# Altium project PCB_Project1.PrjPCB
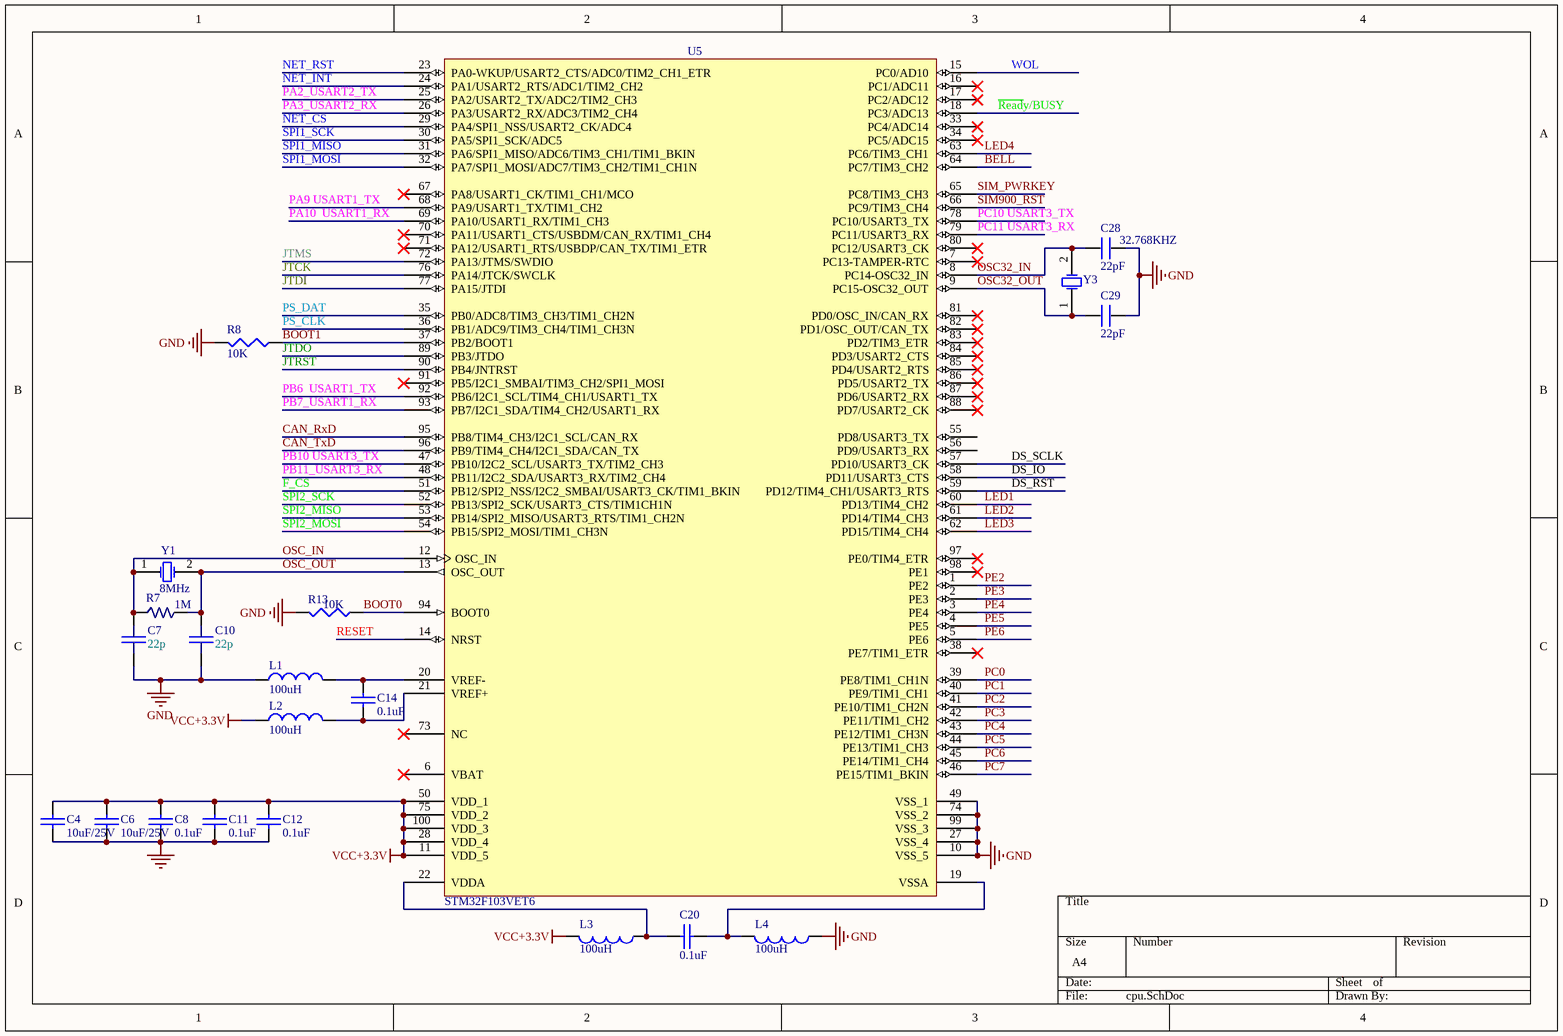
[diagram p0: cpu.SchDoc]
6 sheets, 379 parts. Net scope: global (net labels, ports and power ports of the same name join across sheets).
Board file: 存储物柜V1.1.PcbDoc
Sheets:
  cpu.SchDoc
  other.SchDoc
  power&down.SchDoc
  net_w5500.SchDoc
  gsm_sim900.SchDoc
  存储物柜V1.1.SchDoc

## Sheet cpu.SchDoc
size A4

### Parts
(Parts that share a designator on the sheet are numbered #1, #2 ... from top to bottom, then left to right.)
C4#1  10uF/25V  [0805]
C6#1  10uF/25V  [0805]
C7#1  22p  [0603]
C8#1  0.1uF  [0603]
C10#1  22p  [0603]
C11#1  0.1uF  [0603]
C12#1  0.1uF  [0603]
C14#1  0.1uF  [0603]
C20#1  0.1uF  [0603]
C28  22pF  [0603]
C29  22pF  [0603]
L1#1  100uH  [0805]
L2#1  100uH  [0805]
L3#1  100uH  [0805]
L4#1  100uH  [0805]
R7#1  1M  [0805]
R8#1  10K  [0805]
R13#1  10K  [0603]
U5#1  STM32F103VET6  [LQFP100_N]
Y1#1  8MHz  [XTAL_US]
Y3  32.768KHZ  [CS-308]

### Nets
GND: C4#1.1 C6#1.1 C7#1.2 C8#1.1 C10#1.2 C11#1.1 C12#1.1 C28.1 C29.1 L1#1.1 L4#1.1 R8#1.2 R13#1.2 U5#1.10(VSS_5) U5#1.27(VSS_4) U5#1.49(VSS_1) U5#1.74(VSS_2) U5#1.99(VSS_3)
VCC+3.3V: C4#1.2 C6#1.2 C8#1.2 C11#1.2 C12#1.2 L2#1.1 L3#1.2 U5#1.11(VDD_5) U5#1.28(VDD_4) U5#1.50(VDD_1) U5#1.75(VDD_2) U5#1.100(VDD_3)
BELL: U5#1.64(PC7/TIM3_CH2)
BOOT0: R13#1.1 U5#1.94(BOOT0)
BOOT1: R8#1.1 U5#1.37(PB2/BOOT1)
CAN_RxD: U5#1.95(PB8/TIM4_CH3/I2C1_SCL/CAN_RX)
CAN_TxD: U5#1.96(PB9/TIM4_CH4/I2C1_SDA/CAN_TX)
DS_IO: U5#1.58(PD11/USART3_CTS)
DS_RST: U5#1.59(PD12/TIM4_CH1/USART3_RTS)
DS_SCLK: U5#1.57(PD10/USART3_CK)
F_CS: U5#1.51(PB12/SPI2_NSS/I2C2_SMBAI/USART3_CK/TIM1_BKIN)
JTCK: U5#1.76(PA14/JTCK/SWCLK)
JTDI: U5#1.77(PA15/JTDI)
JTDO: U5#1.89(PB3/JTDO)
JTMS: U5#1.72(PA13/JTMS/SWDIO)
JTRST: U5#1.90(PB4/JNTRST)
LED1: U5#1.60(PD13/TIM4_CH2)
LED2: U5#1.61(PD14/TIM4_CH3)
LED3: U5#1.62(PD15/TIM4_CH4)
LED4: U5#1.63(PC6/TIM3_CH1)
NET_CS: U5#1.29(PA4/SPI1_NSS/USART2_CK/ADC4)
NET_INT: U5#1.24(PA1/USART2_RTS/ADC1/TIM2_CH2)
NET_RST: U5#1.23(PA0-WKUP/USART2_CTS/ADC0/TIM2_CH1_ETR)
OSC32_IN: C28.2 U5#1.8(PC14-OSC32_IN) Y3.2(OSC2)
OSC32_OUT: C29.2 U5#1.9(PC15-OSC32_OUT) Y3.1(OSC1)
OSC_IN: C7#1.1 R7#1.1 U5#1.12(OSC_IN) Y1#1.1(OSC1)
OSC_OUT: C10#1.1 R7#1.2 U5#1.13(OSC_OUT) Y1#1.2(OSC2)
PA2_USART2_TX: U5#1.25(PA2/USART2_TX/ADC2/TIM2_CH3)
PA3_USART2_RX: U5#1.26(PA3/USART2_RX/ADC3/TIM2_CH4)
PA9 USART1_TX: U5#1.68(PA9/USART1_TX/TIM1_CH2)
PA10  USART1_RX: U5#1.69(PA10/USART1_RX/TIM1_CH3)
PB6  USART1_TX: U5#1.92(PB6/I2C1_SCL/TIM4_CH1/USART1_TX)
PB7_USART1_RX: U5#1.93(PB7/I2C1_SDA/TIM4_CH2/USART1_RX)
PB10 USART3_TX: U5#1.47(PB10/I2C2_SCL/USART3_TX/TIM2_CH3)
PB11_USART3_RX: U5#1.48(PB11/I2C2_SDA/USART3_RX/TIM2_CH4)
PC0: U5#1.39(PE8/TIM1_CH1N)
PC1: U5#1.40(PE9/TIM1_CH1)
PC2: U5#1.41(PE10/TIM1_CH2N)
PC3: U5#1.42(PE11/TIM1_CH2)
PC4: U5#1.43(PE12/TIM1_CH3N)
PC5: U5#1.44(PE13/TIM1_CH3)
PC6: U5#1.45(PE14/TIM1_CH4)
PC7: U5#1.46(PE15/TIM1_BKIN)
PC10 USART3_TX: U5#1.78(PC10/USART3_TX)
PC11 USART3_RX: U5#1.79(PC11/USART3_RX)
PE2: U5#1.1(PE2)
PE3: U5#1.2(PE3)
PE4: U5#1.3(PE4)
PE5: U5#1.4(PE5)
PE6: U5#1.5(PE6)
PS_CLK: U5#1.36(PB1/ADC9/TIM3_CH4/TIM1_CH3N)
PS_DAT: U5#1.35(PB0/ADC8/TIM3_CH3/TIM1_CH2N)
~{Read}y/BUSY: U5#1.18(PC3/ADC13)
RESET: U5#1.14(NRST)
SIM900_RST: U5#1.66(PC9/TIM3_CH4)
SIM_PWRKEY: U5#1.65(PC8/TIM3_CH3)
SPI1_MISO: U5#1.31(PA6/SPI1_MISO/ADC6/TIM3_CH1/TIM1_BKIN)
SPI1_MOSI: U5#1.32(PA7/SPI1_MOSI/ADC7/TIM3_CH2/TIM1_CH1N)
SPI1_SCK: U5#1.30(PA5/SPI1_SCK/ADC5)
SPI2_MISO: U5#1.53(PB14/SPI2_MISO/USART3_RTS/TIM1_CH2N)
SPI2_MOSI: U5#1.54(PB15/SPI2_MOSI/TIM1_CH3N)
SPI2_SCK: U5#1.52(PB13/SPI2_SCK/USART3_CTS/TIM1CH1N)
WOL: U5#1.15(PC0/AD10)
NetC14#1_1: C14#1.1 L1#1.2 U5#1.20(VREF-)
NetC14#1_2: C14#1.2 L2#1.2 U5#1.21(VREF+)
NetC20#1_1: C20#1.1 L3#1.1 U5#1.22(VDDA)
NetC20#1_2: C20#1.2 L4#1.2 U5#1.19(VSSA)

Not connected (* = marked no-connect by the designer): U5#1 6(VBAT)* 7(PC13-TAMPER-RTC)* 16(PC1/ADC11)* 17(PC2/ADC12)* 33(PC4/ADC14)* 34(PC5/ADC15)* 38(PE7/TIM1_ETR)* 55(PD8/USART3_TX) 56(PD9/USART3_RX) 67(PA8/USART1_CK/TIM1_CH1/MCO)* 70(PA11/USART1_CTS/USBDM/CAN_RX/TIM1_CH4)* 71(PA12/USART1_RTS/USBDP/CAN_TX/TIM1_ETR)* 73(NC)* 80(PC12/USART3_CK)* 81(PD0/OSC_IN/CAN_RX)* 82(PD1/OSC_OUT/CAN_TX)* 83(PD2/TIM3_ETR)* 84(PD3/USART2_CTS)* 85(PD4/USART2_RTS)* 86(PD5/USART2_TX)* 87(PD6/USART2_RX)* 88(PD7/USART2_CK)* 91(PB5/I2C1_SMBAI/TIM3_CH2/SPI1_MOSI)* 97(PE0/TIM4_ETR)* 98(PE1)*

### Library data of the parts
C4#1 C6#1 C8#1 C11#1 C12#1 C14#1 C20#1 = CAP
C7#1 C10#1 = CAP: 陶瓷电容
C28 C29 = C
L1#1 L2#1 L3#1 L4#1 = INDUCTOR
R7#1 = RES-1%: 高精度电阻
R8#1 R13#1 = RES1
U5#1 = STM32F103VET6: STM32 ARM-based 32-bit MCU with 64 Kbytes Flash, 100-pin LQFP, Industrial Temperature; Published: 30-May-2008; DatasheetVersion: rev6, Mar-2008; PackageVersion: Mar-2008; PackageReference: LQFP100; Publisher: Altium Limited; PackageDescription: 100-Pin Low-Profile Quad Flat Pack, 14 x 14 mm Body, 0.5 mm Pitch (LQFP100); ComponentLink1Description: Manufacturer Link; ComponentLink1URL: www.st.com/stm32; ComponentLink2Description: Datasheet; ComponentLink2URL: http://www.st.com/stonline/products/literature/ds/13587.pdf
Y1#1 Y3 = XTAL: Crystal Oscillator; Published: 8-Jun-2000; LatestRevisionDate: 17-Jul-2002; LatestRevisionNote: Re-released for DXP Platform.; Publisher: Altium Limited

## Sheet other.SchDoc
size A3
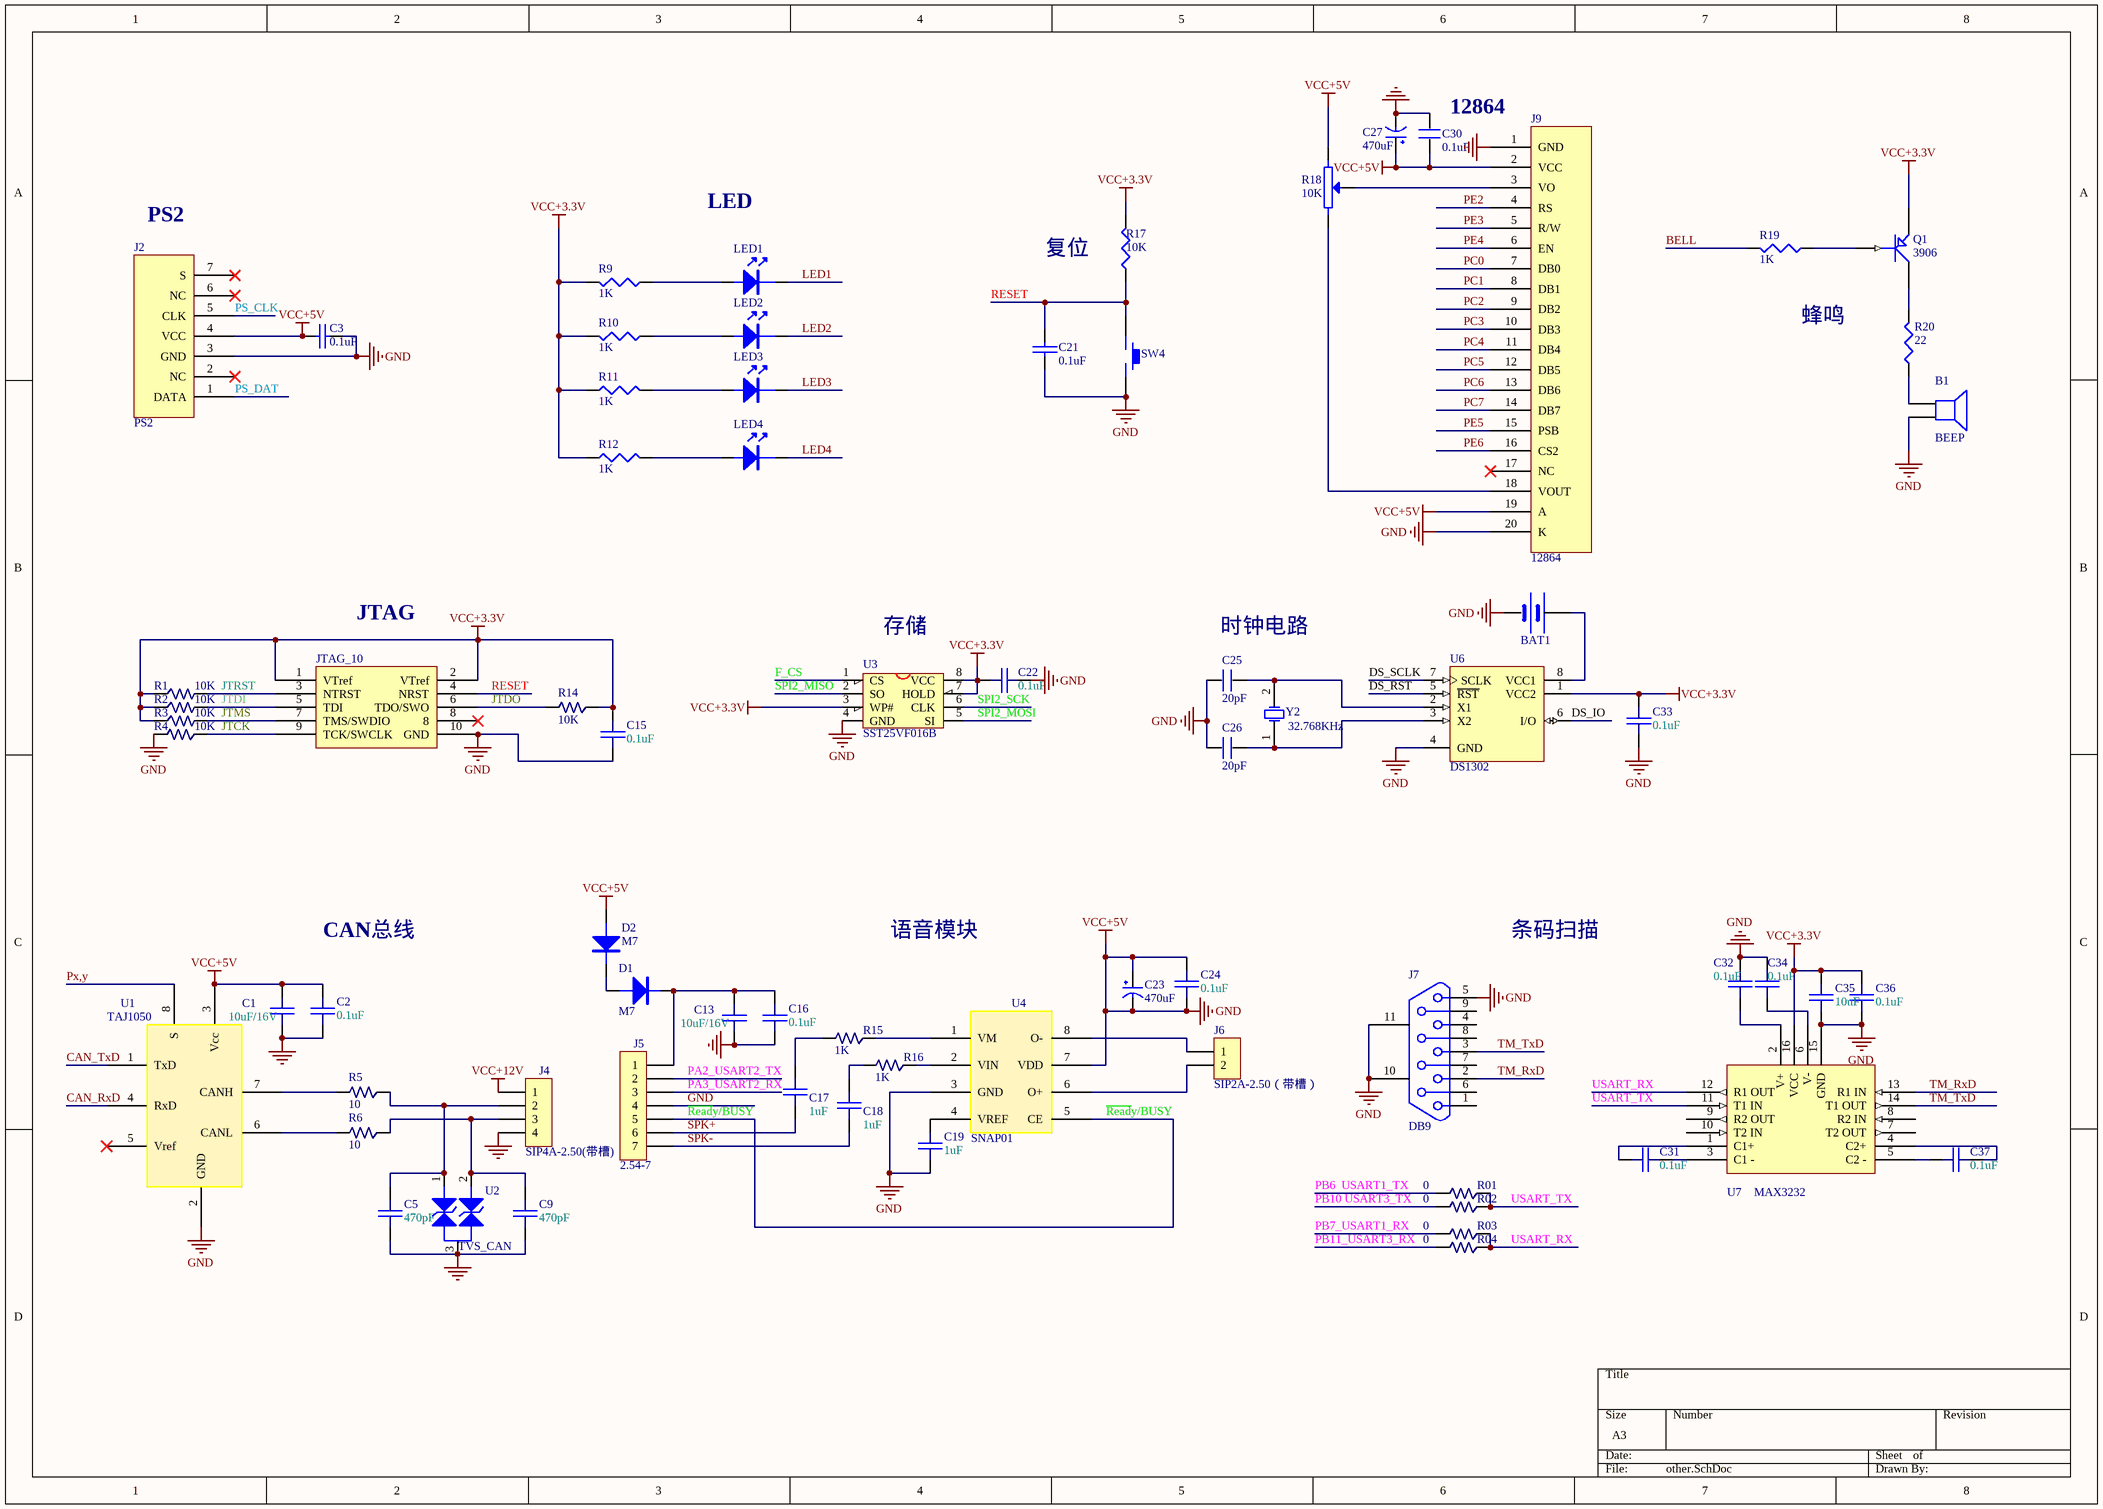
[diagram p1: other.SchDoc]

### Parts
(Parts that share a designator on the sheet are numbered #1, #2 ... from top to bottom, then left to right.)
B1#1  BEEP  [BEEP-12]
BAT1#1  BATT  [BATM]  (value not drawn)
C1#1  10uF/16V  [0805]
C2#1  0.1uF  [0603]
C3#1  0.1uF  [0603]
C5#1  470pF  [0603]
C9#1  470pF  [0603]
C13#1  10uF/16V  [0805]
C15#1  0.1uF  [0603]
C16#1  0.1uF  [0603]
C17#1  1uF  [0603]
C18#1  1uF  [0603]
C19#1  1uF  [0603]
C21#1  0.1uF  [0603]
C22#1  0.1uF  [0603]
C23#1  470uF  [RB5.0-8]
C24#1  0.1uF  [0603]
C25#1  20pF  [0603]
C26#1  20pF  [0603]
C27#1  470uF  [RB5.0-8]
C30#1  0.1uF  [0603]
C31#1  0.1uF  [0603]
C32#1  0.1uF  [0603]
C33#1  0.1uF  [0603]
C34#1  0.1uF  [0603]
C35#1  10uF  [0805]
C36#1  0.1uF  [0603]
C37#1  0.1uF  [0603]
D1#1  M7  [SMB]
D2#1  M7  [SMB]
J2#1  PS2  [PS2-6PIN]
J3#1  JTAG_10  [JTAG_10]
J4#1  SIP4A-2.50(带槽)  [5.08_4P]
J5#1  2.54-7  [SYN6288]
J6#1  SIP2A-2.50（带槽）  [2.54]
J7#1  DB9  [DB9/M]
J9#1  12864  [XH2.54-20P]
LED1#1  (no value)  [LED-0805]
LED2#1  (no value)  [LED-0805]
LED3#1  (no value)  [LED-0805]
LED4#1  (no value)  [LED-0805]
Q1#1  3906  [SOT-23]
R1#1  10K  [0603]
R01#1  0  [0603]
R2#1  10K  [0603]
R02#1  0  [0603]
R3#1  10K  [0603]
R03#1  0  [0603]
R4#1  10K  [0603]
R04#1  0  [0603]
R5#1  10  [0603]
R6#1  10  [0603]
R9#1  1K  [0603]
R10#1  1K  [0603]
R11#1  1K  [0603]
R12#1  1K  [0603]
R14#1  10K  [0603]
R15#1  1K  [0603]
R16#1  1K  [0603]
R17#1  10K  [0603]
R18#1  10K  [RM065-V1]
R19#1  1K  [0603]
R20#1  22  [0603]
SW4#1  KEY_M  [KEY_M]  (value not drawn)
U1#1  TAJ1050  [SO-8]
U2#1  TVS_CAN  [SOT-23]
U3#1  SST25VF016B  [SOIC-8]
U4#1  SNAP01  [sop-8]
U6#1  DS1302  [SOP-8]
U7#1  MAX3232  [SOP-16]
Y2#1  32.768KHz  [cs-308]

### Nets
GND: B1#1.2 BAT1#1.2(GND) C1#1.1 C1#1.2 C2#1.1 C2#1.2 C3#1.1 C3#1.2 C5#1.2 C9#1.2 C13#1.1 C15#1.2 C16#1.1 C19#1.2 C21#1.2 C22#1.2 C23#1.1(VCC) C23#1.2(GND) C24#1.1 C24#1.2 C25#1.1 C26#1.1 C27#1.1(VCC) C27#1.2(GND) C30#1.1 C30#1.2 C32#1.2 C33#1.1 C34#1.2 C35#1.1 C36#1.1 D2#1.1(A) J2#1.3(GND) J2#1.4(VCC) J3#1.10(GND) J4#1.4 J5#1.4 J7#1.5 J7#1.10 J7#1.11 J9#1.1(GND) J9#1.2(VCC) J9#1.19(A) J9#1.20(K) R4#1.2 R18#1.1 SW4#1.2 U1#1.2(GND) U1#1.3(Vcc) U2#1.3 U3#1.4(GND) U4#1.3(GND) U4#1.7(VDD) U6#1.4(GND) U7#1.15(GND)  [also labelled VCC+5V]
VCC+3.3V: C15#1.1 C22#1.1 C33#1.2 C35#1.2 C36#1.2 J3#1.1(VTref) J3#1.2(VTref) Q1#1.2(E) R1#1.1 R2#1.1 R3#1.1 R9#1.2 R10#1.2 R11#1.1 R12#1.1 R14#1.1 R17#1.2 U3#1.3(WP#) U3#1.7(HOLD) U3#1.8(VCC) U6#1.1(VCC2) U7#1.16(VCC)
VCC+12V: J4#1.1
BELL: R19#1.2
CAN_RxD: U1#1.4(RxD)
CAN_TxD: U1#1.1(TxD)
DS_IO: U6#1.6(I/O)
DS_RST: U6#1.5(~{RST})
DS_SCLK: U6#1.7(SCLK)
F_CS: U3#1.1(CS)
JTCK: J3#1.9(TCK/SWCLK) R4#1.1
JTDI: J3#1.5(TDI) R2#1.2
JTDO: J3#1.6(TDO/SWO) R14#1.2
JTMS: J3#1.7(TMS/SWDIO) R3#1.2
JTRST: J3#1.3(NTRST) R1#1.2
LED1: LED1#1.2
LED2: LED2#1.2
LED3: LED3#1.2
LED4: LED4#1.2
PA2_USART2_TX: J5#1.2
PA3_USART2_RX: J5#1.3
PB6  USART1_TX: R01#1.2
PB7_USART1_RX: R03#1.2
PB10 USART3_TX: R02#1.2
PB11_USART3_RX: R04#1.2
PC0: J9#1.7(DB0)
PC1: J9#1.8(DB1)
PC2: J9#1.9(DB2)
PC3: J9#1.10(DB3)
PC4: J9#1.11(DB4)
PC5: J9#1.12(DB5)
PC6: J9#1.13(DB6)
PC7: J9#1.14(DB7)
PE2: J9#1.4(RS)
PE3: J9#1.5(R/W)
PE4: J9#1.6(EN)
PE5: J9#1.15(PSB)
PE6: J9#1.16(CS2)
PS_CLK: J2#1.5(CLK)
PS_DAT: J2#1.1(DATA)
Px,y: U1#1.8(S)
~{Read}y/BUSY: J5#1.5 U4#1.5(CE)
RESET: C21#1.1 J3#1.4(NRST) R17#1.1 SW4#1.1
SPI2_MISO: U3#1.2(SO)
SPI2_MOSI: U3#1.5(SI)
SPI2_SCK: U3#1.6(CLK)
SPK+: C17#1.1 J5#1.6
SPK-: C18#1.1 J5#1.7
TM_RxD: J7#1.2 U7#1.13(R1_IN)
TM_TxD: J7#1.3 U7#1.14(T1_OUT)
USART_RX: R03#1.1 R04#1.1 U7#1.12(R1_OUT)
USART_TX: R01#1.1 R02#1.1 U7#1.11(T1_IN)
NetB1#1_1: B1#1.1 R20#1.1
NetBAT1#1_1: BAT1#1.1(VCC) U6#1.8(VCC1)
NetC5#1_1: C5#1.1 J4#1.2 R5#1.1 U2#1.1
NetC9#1_1: C9#1.1 J4#1.3 R6#1.1 U2#1.2(K)
NetC13#1_2: C13#1.2 C16#1.2 D1#1.2(K) J5#1.1
NetC17#1_2: C17#1.2 R15#1.2
NetC18#1_2: C18#1.2 R16#1.2
NetC19#1_1: C19#1.1 U4#1.4(VREF)
NetC25#1_2: C25#1.2 U6#1.2(X1) Y2#1.2(OSC2)
NetC26#1_2: C26#1.2 U6#1.3(X2) Y2#1.1(OSC1)
NetC31#1_1: C31#1.1 U7#1.1(C1+)
NetC31#1_2: C31#1.2 U7#1.3(C1_-)
NetC32#1_1: C32#1.1 U7#1.2(V+)
NetC34#1_1: C34#1.1 U7#1.6(V-)
NetC37#1_1: C37#1.1 U7#1.5(C2_-)
NetC37#1_2: C37#1.2 U7#1.4(C2+)
NetD1#1_1: D1#1.1(A) D2#1.2(K)
NetJ6#1_1: J6#1.1 U4#1.8(O-)
NetJ6#1_2: J6#1.2 U4#1.6(O+)
NetJ9#1_3: J9#1.3(VO) R18#1.2
NetJ9#1_18: J9#1.18(VOUT) R18#1.3
NetLED1#1_1: LED1#1.1 R9#1.1
NetLED2#1_1: LED2#1.1 R10#1.1
NetLED3#1_1: LED3#1.1 R11#1.2
NetLED4#1_1: LED4#1.1 R12#1.2
NetQ1#1_1: Q1#1.1(B) R19#1.1
NetQ1#1_3: Q1#1.3(C) R20#1.2
NetR5#1_2: R5#1.2 U1#1.7(CANH)
NetR6#1_2: R6#1.2 U1#1.6(CANL)
NetR15#1_1: R15#1.1 U4#1.1(VM)
NetR16#1_1: R16#1.1 U4#1.2(VIN)

Not connected (* = marked no-connect by the designer): J2#1 2(NC)* 6(NC)* 7(S)*; J3#1 8*; J7#1 1 4 6 7 8 9; J9#1 17(NC)*; U1#1 5(Vref)*; U7#1 7(T2_OUT) 8(R2_IN) 9(R2_OUT) 10(T2_IN)

### Notes on the sheet
- (near C30#1) 12864
- (near J2#1) PS2
- LED
- 复位
- 蜂鸣
- JTAG
- (near U3#1) 存储
- (near C25#1) 时钟电路
- CAN总线
- 语音模块
- 条码扫描

### Library data of the parts
B1#1 = SPEAKER
BAT1#1 = BAT
C1#1 C2#1 C5#1 C9#1 C13#1 C15#1 C16#1 C17#1 C18#1 C19#1 C22#1 C24#1 C31#1 C32#1 C33#1 C34#1 C35#1 C36#1 C37#1 = CAP: 陶瓷电容
C3#1 C21#1 C23#1 C27#1 = CAP
C25#1 C26#1 C30#1 = C
D1#1 D2#1 = DIODE
LED1#1 LED2#1 LED3#1 LED4#1 = LED
Q1#1 = PNP1
R1#1 R01#1 R2#1 R02#1 R3#1 R03#1 R4#1 R04#1 R5#1 R6#1 R14#1 R15#1 R16#1 = RES-1%: 高精度电阻
R9#1 R10#1 R11#1 R12#1 R17#1 R19#1 R20#1 = RES1
R18#1 = POT2
U3#1 = W25X16: W25X16;SST25VF016;MX25L1605
U6#1 = DS1302: 实时时钟
U7#1 = MAX232
Y2#1 = XTAL: Crystal Oscillator; Published: 8-Jun-2000; LatestRevisionDate: 17-Jul-2002; LatestRevisionNote: Re-released for DXP Platform.; Publisher: Altium Limited

## Sheet power&down.SchDoc
size A4
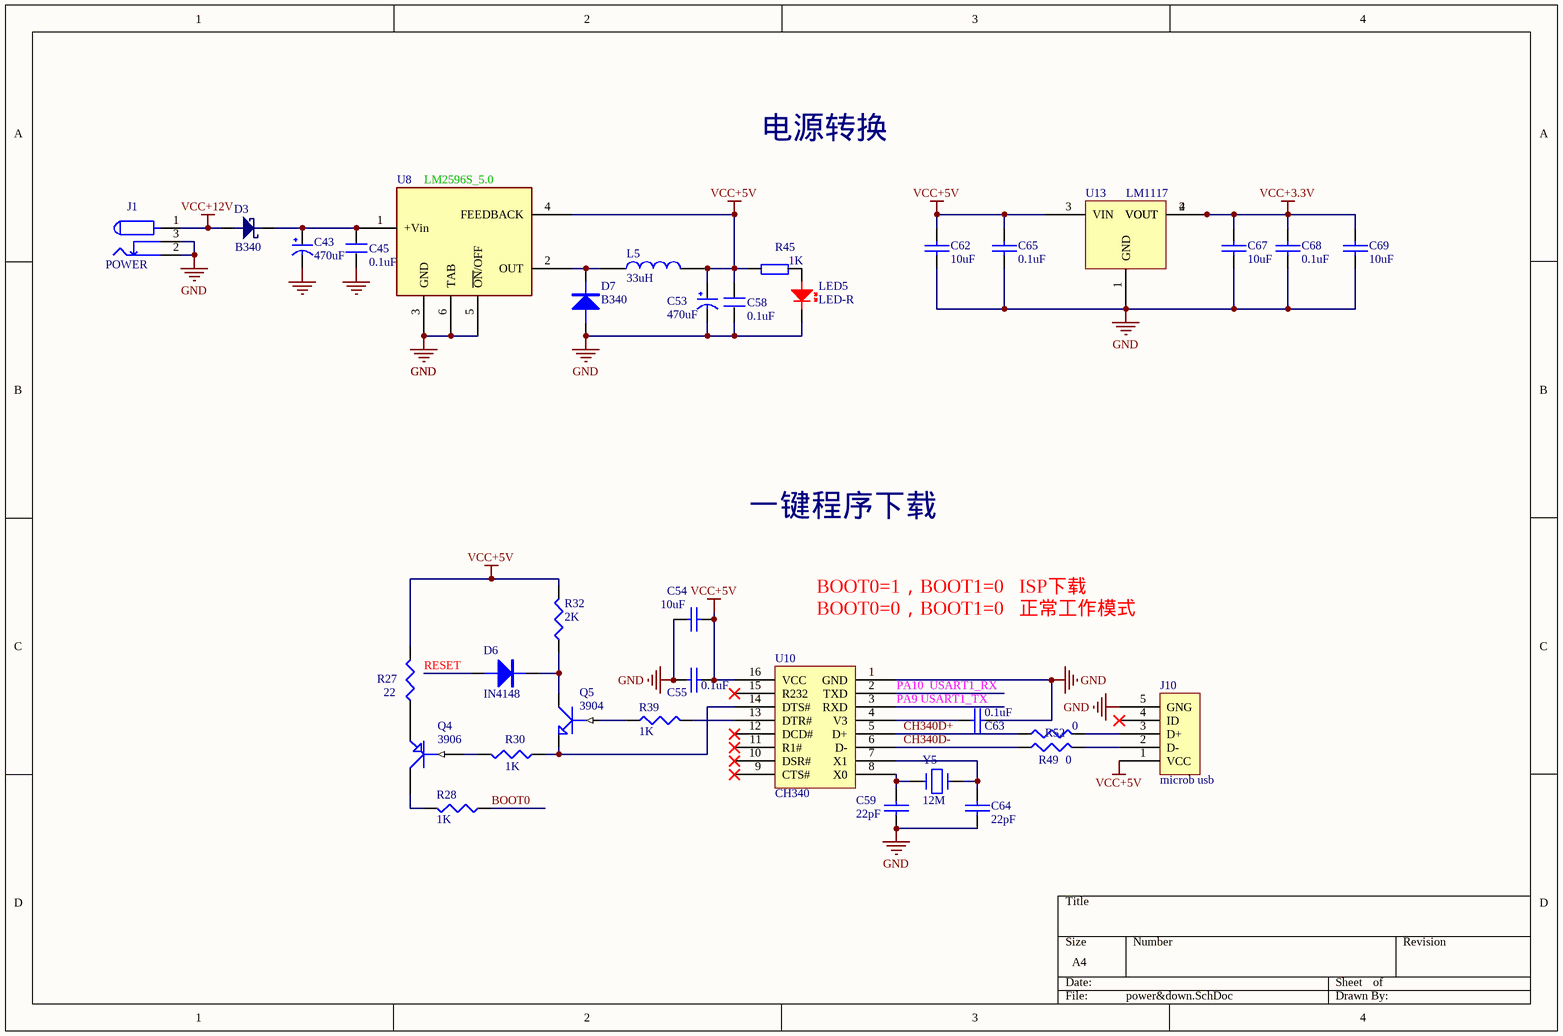
[diagram p2: power&down.SchDoc]

### Parts
(Parts that share a designator on the sheet are numbered #1, #2 ... from top to bottom, then left to right.)
C43#1  470uF  [RB5.0-8]
C45#1  0.1uF  [0603]
C53#1  470uF  [RB5.0-8]
C54#1  10uF  [0805]
C55#1  0.1uF  [0603]
C58#1  0.1uF  [0603]
C59#1  22pF  [0603]
C62#1  10uF  [0805]
C63#1  0.1uF  [0603]
C64#1  22pF  [0603]
C65#1  0.1uF  [0603]
C67#1  10uF  [0805]
C68#1  0.1uF  [0603]
C69#1  10uF  [0805]
D3#1  B340  [SMB]
D6#1  IN4148  [SOD-23]
D7#1  B340  [SMB]
J1#1  POWER  [DC10B]
J10#1  microb usb  [USB_micro]
L5#1  33uH  [INDUCTOR-1212]
LED5#1  LED-R  [LED-0805]
Q4#1  3906  [SOT-23]
Q5#1  3904  [SOT-23]
R27#1  22  [0603]
R28#1  1K  [0603]
R30#1  1K  [0603]
R32#1  2K  [0603]
R39#1  1K  [0603]
R45#1  1K  [0603]
R49#1  0  [0603]
R52#1  0  [0603]
U8#1  LM2596S_5.0  [TO-263-5]
U10#1  CH340  [SOP16]
U13#1  LM1117  [AMS1117]
Y5#1  12M  [XTAL_US]

### Nets
GND: C43#1.2(GND) C45#1.1 C53#1.1(VCC) C53#1.2(GND) C54#1.1 C54#1.2 C55#1.1 C55#1.2 C58#1.1 C58#1.2 C59#1.1 C62#1.1 C62#1.2 C63#1.1 C64#1.2 C65#1.1 C65#1.2 C67#1.2 C68#1.2 C69#1.2 D7#1.1(A) J1#1.2 J1#1.3 J10#1.1(VCC) J10#1.5(GNG) L5#1.2 LED5#1.2 R27#1.2 R32#1.2 R45#1.1 U8#1.3(GND) U8#1.4(FEEDBACK) U8#1.5(~{ON}/OFF) U8#1.6(TAB) U10#1.1(GND) U10#1.16(VCC) U13#1.1(GND) U13#1.3(VIN)  [also labelled VCC+5V]
VCC+3.3V: C67#1.1 C68#1.1 C69#1.1 U13#1.2(VOUT) U13#1.4(VOUT)
VCC+12V: D3#1.1 J1#1.1
BOOT0: R28#1.1
CH340D+: R52#1.1 U10#1.5(D+)
CH340D-: R49#1.1 U10#1.6(D-)
PA9 USART1_TX: U10#1.3(RXD)
PA10  USART1_RX: U10#1.2(TXD)
RESET: D6#1.1(A)
NetC43#1_1: C43#1.1(VCC) C45#1.2 D3#1.2 U8#1.1(+Vin)
NetC59#1_2: C59#1.2 U10#1.8(X0) Y5#1.1
NetC63#1_2: C63#1.2 U10#1.4(V3)
NetC64#1_1: C64#1.1 U10#1.7(X1) Y5#1.2
NetD6#1_2: D6#1.2(K) Q5#1.3(C) R32#1.1
NetD7#1_2: D7#1.2(K) L5#1.1 U8#1.2(OUT)
NetJ10#1_2: J10#1.2(D-) R49#1.2
NetJ10#1_3: J10#1.3(D+) R52#1.2
NetLED5#1_1: LED5#1.1 R45#1.2
NetQ4#1_1: Q4#1.1(B) R30#1.2
NetQ4#1_2: Q4#1.2(E) R27#1.1
NetQ4#1_3: Q4#1.3(C) R28#1.2
NetQ5#1_1: Q5#1.1(B) R39#1.1
NetQ5#1_2: Q5#1.2(E) R30#1.1 U10#1.14(DTS#)
NetR39#1_2: R39#1.2 U10#1.13(DTR#)

Not connected (* = marked no-connect by the designer): J10#1 4(ID)*; U10#1 9(CTS#)* 10(DSR#)* 11(R1#)* 12(DCD#)* 15(R232)*

### Notes on the sheet
- 电源转换
- 一键程序下载
- BOOT0=1，BOOT1=0   ISP下载
  BOOT0=0，BOOT1=0   正常工作模式

### Library data of the parts
C43#1 C53#1 C55#1 C62#1 C63#1 C65#1 C67#1 C68#1 C69#1 = CAP
C45#1 C58#1 = C
C54#1 C59#1 C64#1 = CAP: 0.1uF
D3#1 = 1N5824(SS54): 肖特基二极管
D6#1 D7#1 = DIODE
J1#1 = POW
L5#1 = INDUCTOR
LED5#1 = LED-RED: 红色LED
Q4#1 = PNP1
Q5#1 = NPN1
R27#1 R28#1 R30#1 R32#1 R39#1 R49#1 R52#1 = RES1
R45#1 = Res
U8#1 = LM2596S_5.0: 3A开关电源芯片
Y5#1 = CRYSTAL

## Sheet net_w5500.SchDoc
size A4
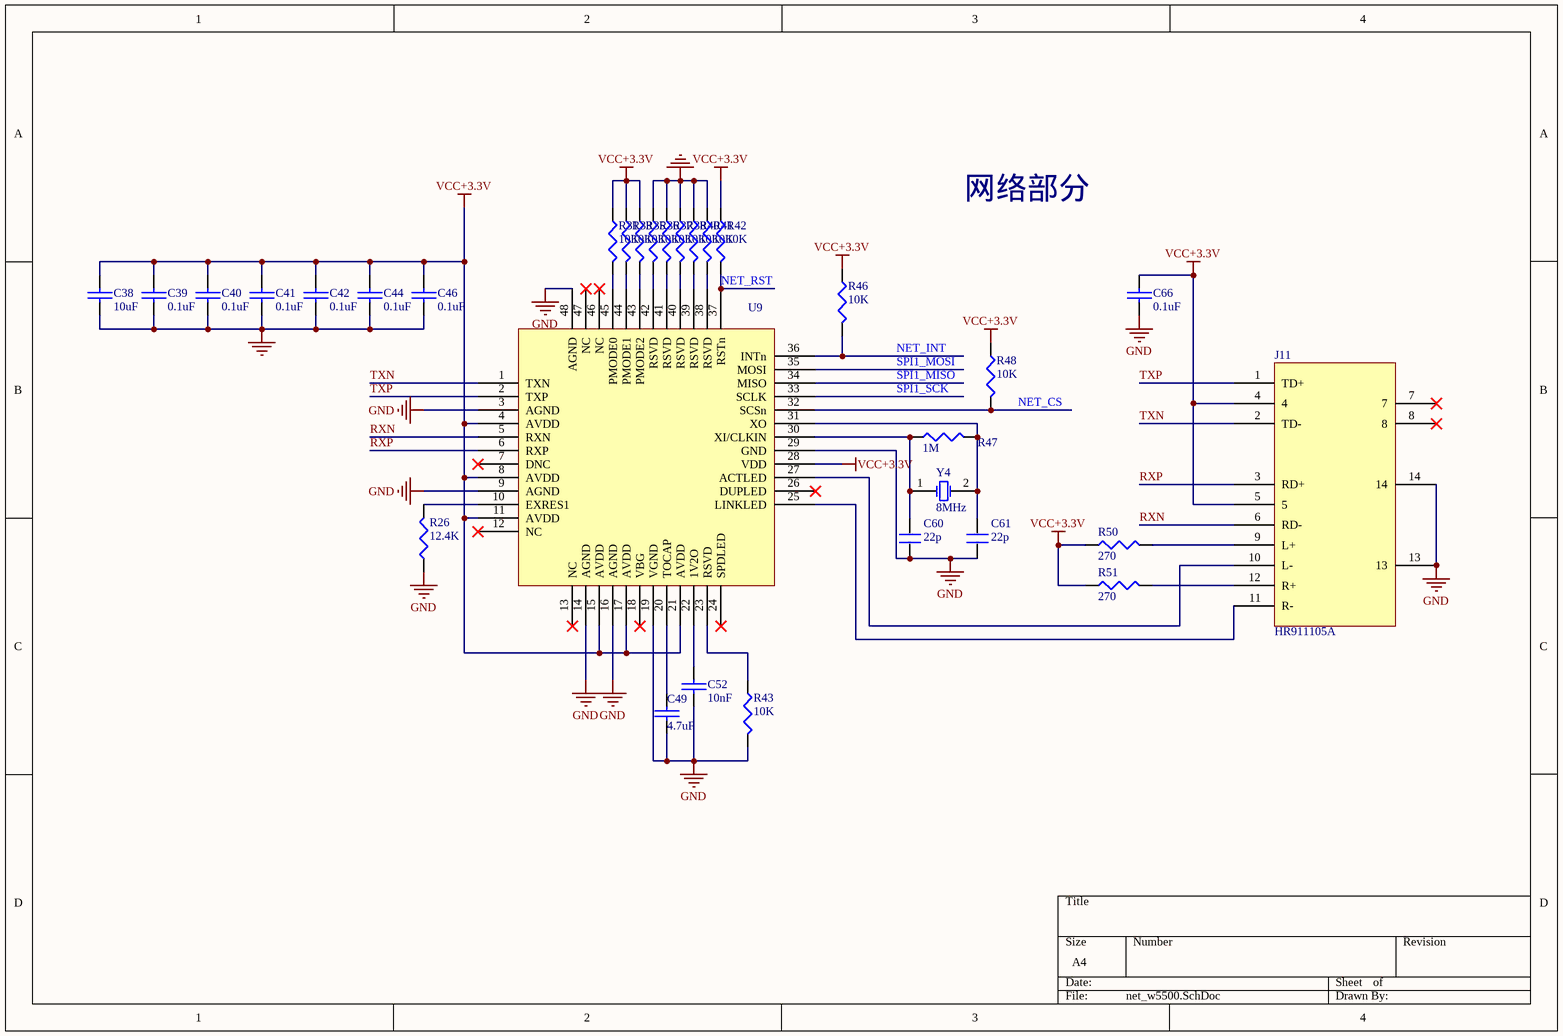
[diagram p3: net_w5500.SchDoc]

### Parts
(Parts that share a designator on the sheet are numbered #1, #2 ... from top to bottom, then left to right.)
C38  10uF  [0805]
C39#1  0.1uF  [0603]
C40  0.1uF  [0603]
C41#1  0.1uF  [0603]
C42#1  0.1uF  [0603]
C44  0.1uF  [0603]
C46#1  0.1uF  [0603]
C49#1  4.7uF  [0805]
C52#1  10nF  [0603]
C60#1  22p  [0603]
C61#1  22p  [0603]
C66#1  0.1uF  [0603]
J11#1  HR911105A  [HR911105A]
R26#1  12.4K  [0603]
R31#1  10K  [0603]
R33#1  10K  [0603]
R35#1  10K  [0603]
R36#1  10K  [0603]
R37#1  10K  [0603]
R38#1  10K  [0603]
R40#1  10K  [0603]
R41#1  10K  [0603]
R42#1  10K  [0603]
R43#1  10K  [0603]
R46#1  10K  [0603]
R47#1  1M  [0603]
R48#1  10K  [0603]
R50#1  270  [0603]
R51#1  270  [0603]
U9#1  W5500  [LQFP48_N]  (value not drawn)
Y4#1  8MHz  [XTAL_US]

### Nets
GND: C38.1 C39#1.2 C40.2 C41#1.2 C42#1.2 C44.2 C46#1.2 C49#1.1 C52#1.2 C60#1.1 C61#1.1 C66#1.2 J11#1.13 J11#1.14 R26#1.1 R36#1.1 R37#1.1 R38#1.1 R40#1.1 R41#1.1 R43#1.2 U9#1.3(AGND) U9#1.9(AGND) U9#1.14(AGND) U9#1.16(AGND) U9#1.19(VGND) U9#1.29(GND) U9#1.48(AGND)
VCC+3.3V: C38.2 C39#1.1 C40.1 C41#1.1 C42#1.1 C44.1 C46#1.1 C66#1.1 J11#1.4 J11#1.5 R31#1.1 R33#1.1 R35#1.1 R42#1.1 R46#1.1 R48#1.1 R50#1.1 R51#1.1 U9#1.4(AVDD) U9#1.8(AVDD) U9#1.11(AVDD) U9#1.15(AVDD) U9#1.17(AVDD) U9#1.21(AVDD) U9#1.28(VDD)
NET_CS: R48#1.2 U9#1.32(SCSn)
NET_INT: R46#1.2 U9#1.36(INTn)
NET_RST: R42#1.2 U9#1.37(RSTn)
RXN: J11#1.6(RD-) U9#1.5(RXN)
RXP: J11#1.3(RD+) U9#1.6(RXP)
SPI1_MISO: U9#1.34(MISO)
SPI1_MOSI: U9#1.35(MOSI)
SPI1_SCK: U9#1.33(SCLK)
TXN: J11#1.2(TD-) U9#1.1(TXN)
TXP: J11#1.1(TD+) U9#1.2(TXP)
NetC49#1_2: C49#1.2 U9#1.20(TOCAP)
NetC52#1_1: C52#1.1 U9#1.22(1V2O)
NetC60#1_2: C60#1.2 R47#1.1 U9#1.30(XI/CLKIN) Y4#1.1(OSC1)
NetC61#1_2: C61#1.2 R47#1.2 U9#1.31(XO) Y4#1.2(OSC2)
NetJ11#1_9: J11#1.9(L+) R50#1.2
NetJ11#1_10: J11#1.10(L-) U9#1.27(ACTLED)
NetJ11#1_11: J11#1.11(R-) U9#1.25(LINKLED)
NetJ11#1_12: J11#1.12(R+) R51#1.2
NetR26#1_2: R26#1.2 U9#1.10(EXRES1)
NetR31#1_2: R31#1.2 U9#1.45(PMODE0)
NetR33#1_2: R33#1.2 U9#1.44(PMODE1)
NetR35#1_2: R35#1.2 U9#1.43(PMODE2)
NetR36#1_2: R36#1.2 U9#1.42(RSVD)
NetR37#1_2: R37#1.2 U9#1.41(RSVD)
NetR38#1_2: R38#1.2 U9#1.40(RSVD)
NetR40#1_2: R40#1.2 U9#1.39(RSVD)
NetR41#1_2: R41#1.2 U9#1.38(RSVD)
NetR43#1_1: R43#1.1 U9#1.23(RSVD)

Not connected (* = marked no-connect by the designer): J11#1 7* 8*; U9#1 7(DNC)* 12(NC)* 13(NC)* 18(VBG)* 24(SPDLED)* 26(DUPLED)* 46(NC)* 47(NC)*

### Notes on the sheet
- 网络部分

### Library data of the parts
C38 C49#1 = CAP: 0.1uF
C39#1 C40 C41#1 C42#1 C44 C46#1 C52#1 C66#1 = CAP
C60#1 C61#1 = C
R26#1 R31#1 R33#1 R35#1 R36#1 R37#1 R38#1 R40#1 R41#1 R42#1 R43#1 R46#1 R47#1 R48#1 R50#1 R51#1 = RES1
U9#1 = W5500: 以太网
Y4#1 = XTAL: Crystal Oscillator; Published: 8-Jun-2000; LatestRevisionDate: 17-Jul-2002; LatestRevisionNote: Re-released for DXP Platform.; Publisher: Altium Limited

## Sheet gsm_sim900.SchDoc
size A4
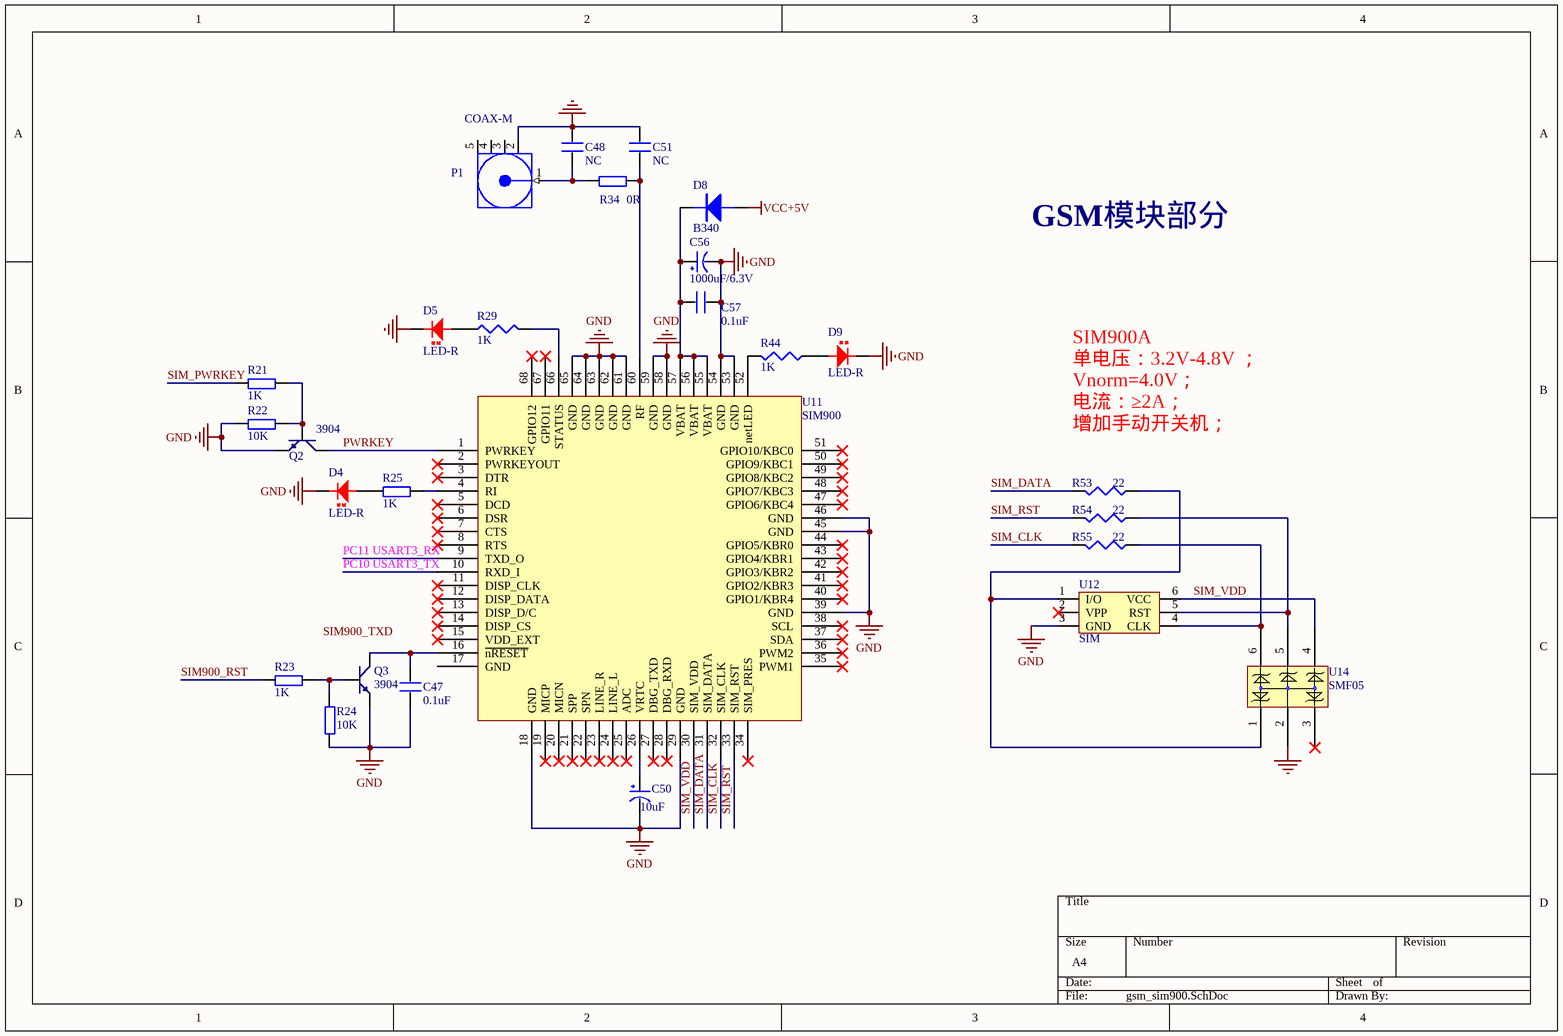
[diagram p4: gsm_sim900.SchDoc]

### Parts
(Parts that share a designator on the sheet are numbered #1, #2 ... from top to bottom, then left to right.)
C47#1  0.1uF  [0603]
C48#1  NC  [0603]
C50#1  10uF  [0805]
C51#1  NC  [0603]
C56#1  1000uF/6.3V  [7343]
C57#1  0.1uF  [0603]
D4#1  LED-R  [LED-0805]
D5#1  LED-R  [LED-0805]
D8#1  B340  [SMB]
D9#1  LED-R  [LED-0805]
P1#1  COAX-M  [ST-TH1]
Q2#1  3904  [SOT-23R]
Q3#1  3904  [SOT-23R]
R21#1  1K  [0603]
R22#1  10K  [0603]
R23#1  1K  [0603]
R24#1  10K  [0603]
R25#1  1K  [0603]
R29#1  1K  [0603]
R34#1  0R  [0603]
R44#1  1K  [0603]
R53#1  22  [0603]
R54#1  22  [0603]
R55#1  22  [0603]
U11#1  SIM900  [SIM-900]
U12#1  SIM  [sim-6p]
U14#1  SMF05  [SC70-6L]

### Nets
GND: C47#1.1 C48#1.2 C50#1.2(GND) C51#1.2 C56#1.2(GND) C57#1.2 D4#1.2 D5#1.2 D8#1.1(A) D9#1.2 P1#1.2(GND) Q2#1.1(E) Q3#1.1(E) R22#1.1 R24#1.1 U11#1.18(GND) U11#1.29(GND) U11#1.39(GND) U11#1.45(GND) U11#1.46(GND) U11#1.53(GND) U11#1.54(GND) U11#1.58(GND) U11#1.59(GND) U11#1.61(GND) U11#1.62(GND) U11#1.63(GND) U11#1.64(GND) U11#1.65(GND) U12#1.3(GND) U14#1.2  [also labelled VCC+5V]
PC10 USART3_TX: U11#1.10(RXD_I)
PC11 USART3_RX: U11#1.9(TXD_O)
PWRKEY: Q2#1.3(C) U11#1.1(PWRKEY)
SIM900_RST: R23#1.1
SIM_CLK: R55#1.2 U11#1.32(SIM_CLK)
SIM_DATA: R53#1.2 U11#1.31(SIM_DATA)
SIM_PWRKEY: R21#1.1
SIM_RST: R54#1.2 U11#1.33(SIM_RST)
SIM_VDD: U11#1.30(SIM_VDD) U12#1.6(VCC) U14#1.4
NetC47#1_2: C47#1.2 Q3#1.3(C) U11#1.16(~{nRESET})
NetC48#1_1: C48#1.1 P1#1.1(Signal) R34#1.1
NetC50#1_1: C50#1.1(VCC) U11#1.26(VRTC)
NetC51#1_1: C51#1.1 R34#1.2 U11#1.60(RF)
NetC56#1_1: C56#1.1(VCC) C57#1.1 D8#1.2(K) U11#1.55(VBAT) U11#1.56(VBAT) U11#1.57(VBAT)
NetD4#1_1: D4#1.1 R25#1.1
NetD5#1_1: D5#1.1 R29#1.1
NetD9#1_1: D9#1.1 R44#1.1
NetQ2#1_2: Q2#1.2(B) R21#1.2 R22#1.2
NetQ3#1_2: Q3#1.2(B) R23#1.2 R24#1.2
NetR25#1_2: R25#1.2 U11#1.4(RI)
NetR29#1_2: R29#1.2 U11#1.66(STATUS)
NetR44#1_2: R44#1.2 U11#1.52(netLED)
NetR53#1_1: R53#1.1 U12#1.1(I/O) U14#1.1
NetR54#1_1: R54#1.1 U12#1.5(RST) U14#1.5
NetR55#1_1: R55#1.1 U12#1.4(CLK) U14#1.6

Not connected (* = marked no-connect by the designer): P1#1 3(GND) 4(GND) 5(GND); U11#1 2(PWRKEYOUT)* 3(DTR)* 5(DCD)* 6(DSR)* 7(CTS)* 8(RTS)* 11(DISP_CLK)* 12(DISP_DATA)* 13(DISP_D/C)* 14(DISP_CS)* 15(VDD_EXT)* 17(GND) 19(MICP)* 20(MICN)* 21(SPP)* 22(SPN)* 23(LINE_R)* 24(LINE_L)* 25(ADC)* 27(DBG_TXD)* 28(DBG_RXD)* 34(SIM_PRES)* 35(PWM1)* 36(PWM2)* 37(SDA)* 38(SCL)* 40(GPIO1/KBR4)* 41(GPIO2/KBR3)* 42(GPIO3/KBR2)* 43(GPIO4/KBR1)* 44(GPIO5/KBR0)* 47(GPIO6/KBC4)* 48(GPIO7/KBC3)* 49(GPIO8/KBC2)* 50(GPIO9/KBC1)* 51(GPIO10/KBC0)* 67(GPIO11)* 68(GPIO12)*; U12#1 2(VPP)*; U14#1 3*

### Notes on the sheet
- GSM模块部分
- (near R53#1) SIM900A
  单电压：3.2V-4.8V ；
  Vnorm=4.0V；
  电流：≥2A；
  增加手动开关机；
- Labels drawn without touching a wire or pin: SIM900_TXD

### Library data of the parts
C47#1 C48#1 C51#1 C57#1 = C
C50#1 C56#1 = CAP
D4#1 D5#1 D9#1 = LED-RED: 红色LED
D8#1 = DIODE
P1#1 = COAX-M: SMA-J-P-H-ST-TH1; PackageDocument: Rev. A, 16-Jun-1997; PCB_Layout: Complies with manufacturer's recommendation.; DrillSize: Corresponds to nominal value.; Published: 15-Jul-2004; LatestRevisionDate: 15-Jul-2004; LatestRevisionNote: Component Replaced.; DatasheetDocument: 30-May-2003; PackageReference: 908-21103; Publisher: Altium Limited; ComponentLink1Description: Manufacturer Link; ComponentLink1URL: http://www.amphenolrf.com/
Q2#1 Q3#1 = NPN: 8050/BCW846/BCW847
R21#1 R22#1 R23#1 R24#1 R25#1 R34#1 = Res
R29#1 R44#1 R53#1 R54#1 R55#1 = RES1
U12#1 = SIM: 手机SIM卡

## Sheet 存储物柜V1.1.SchDoc
size A1
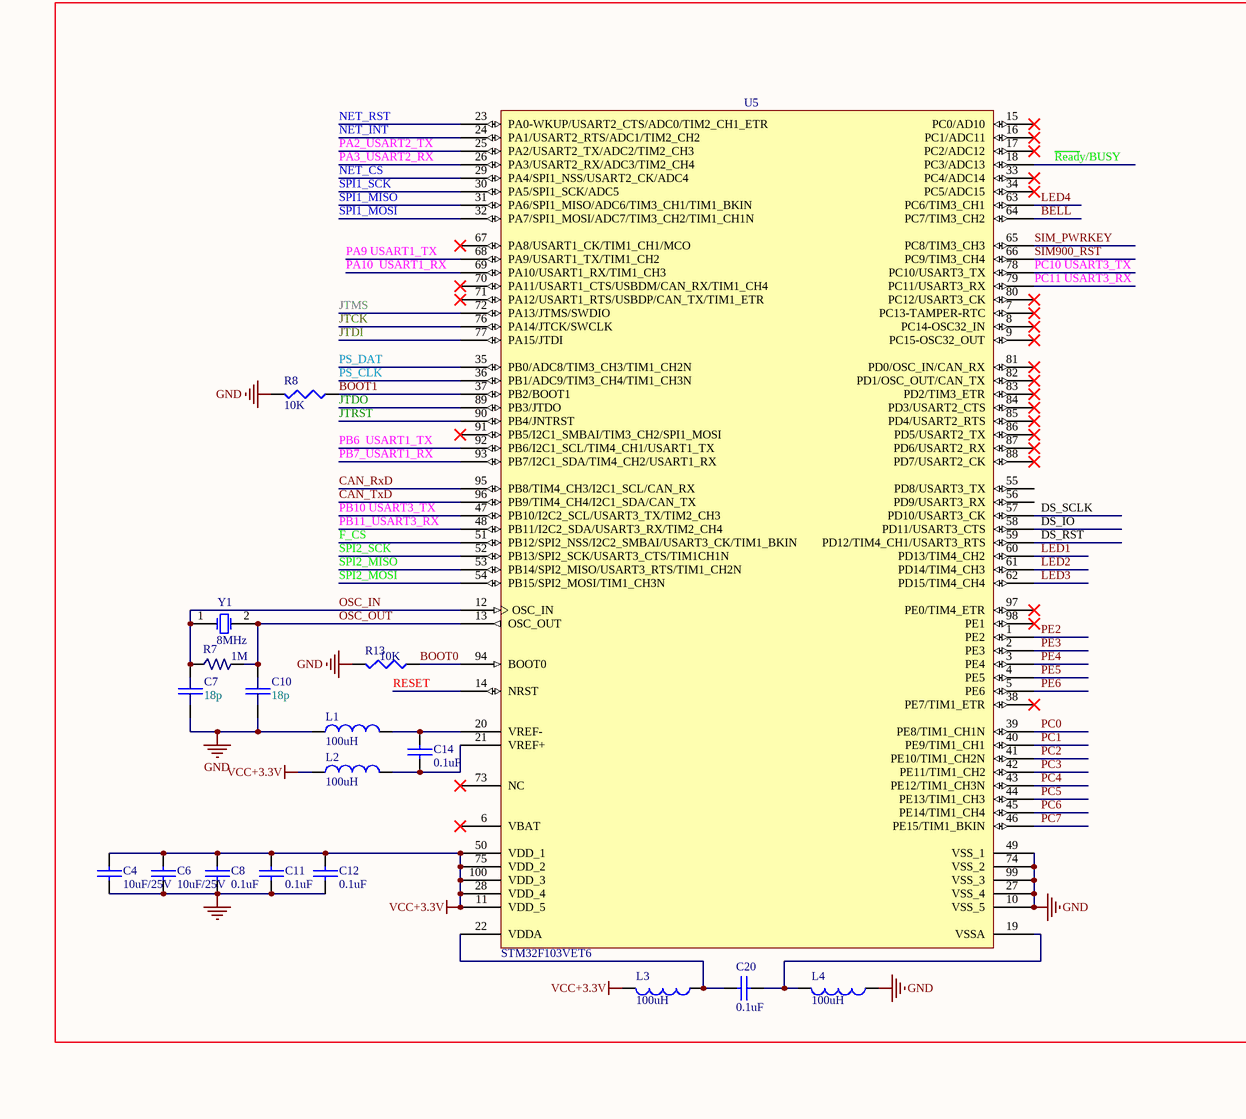
[diagram p5: 存储物柜V1.1.SchDoc, top left]
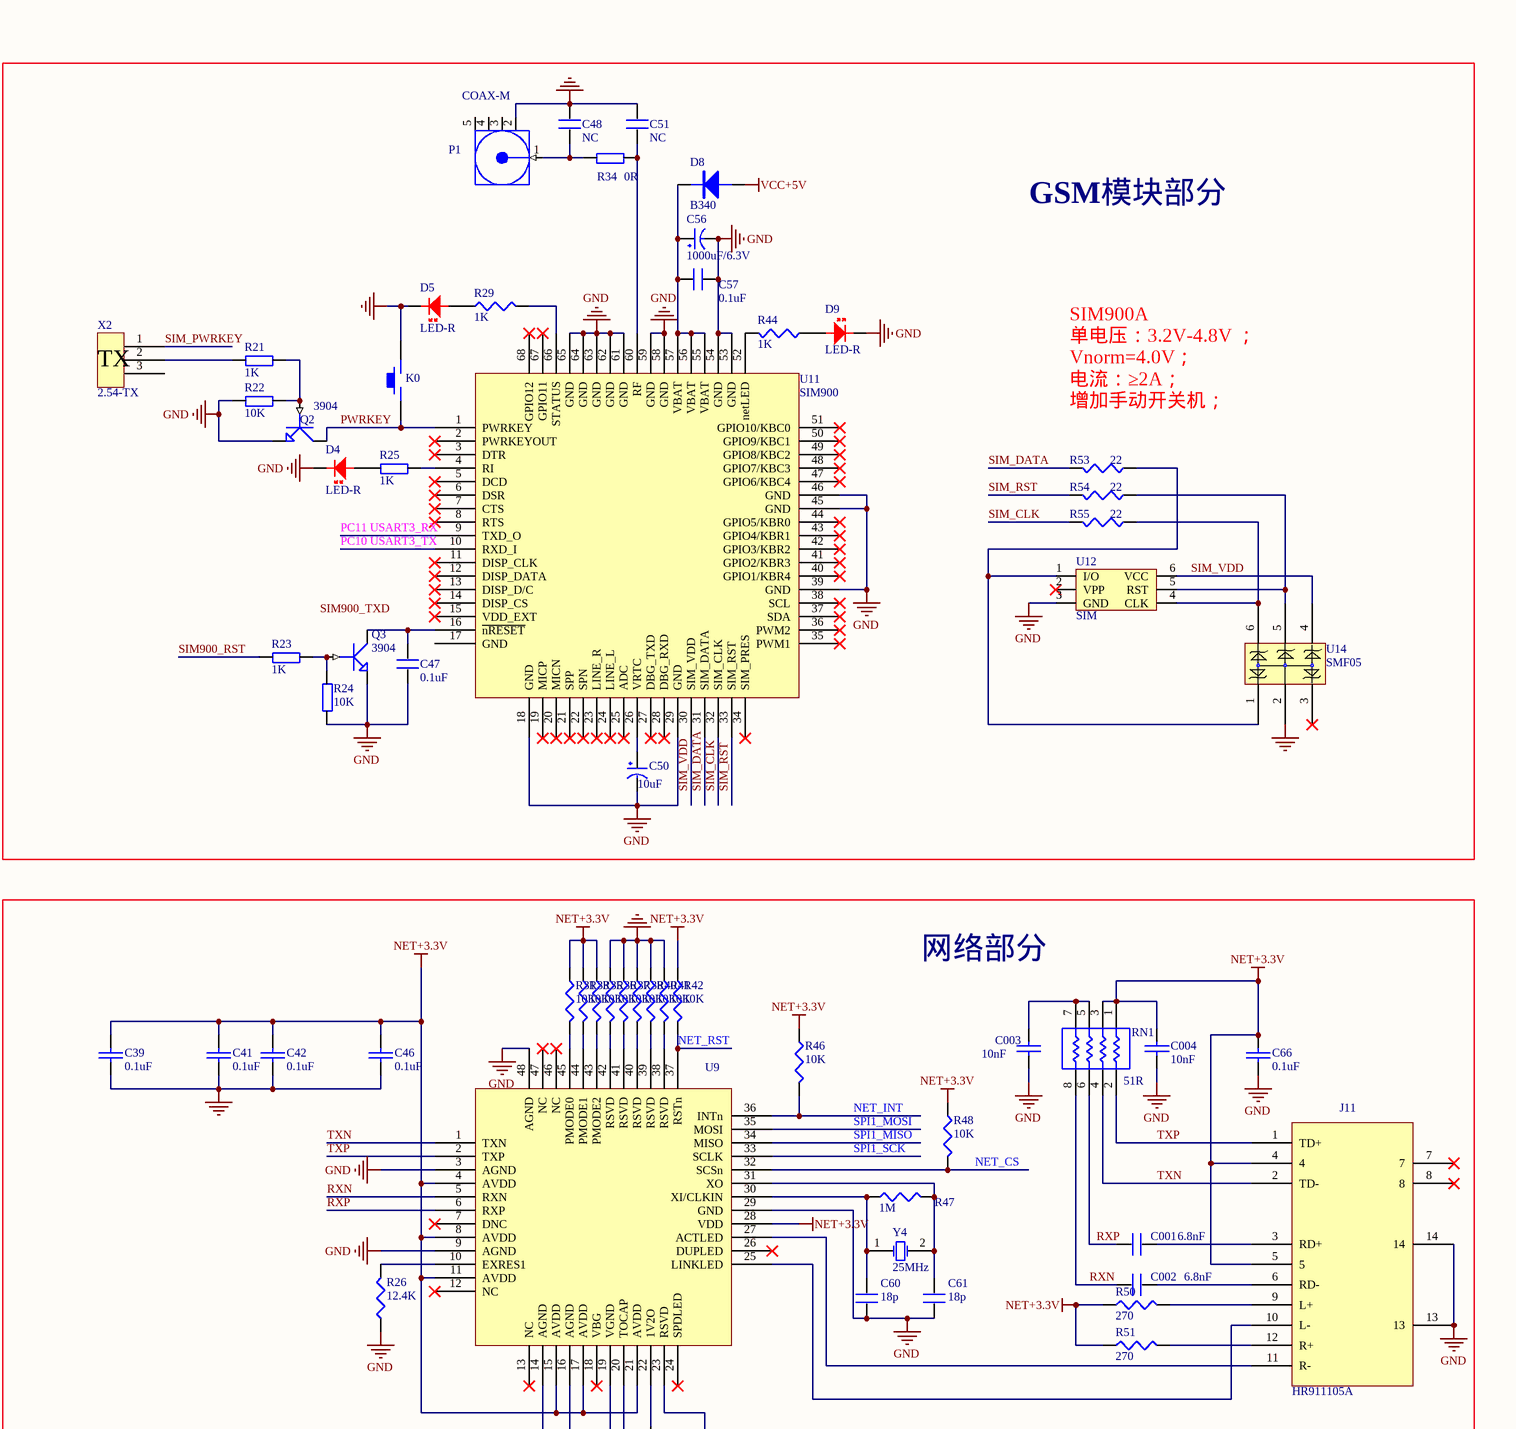
[diagram p6: 存储物柜V1.1.SchDoc, top right]
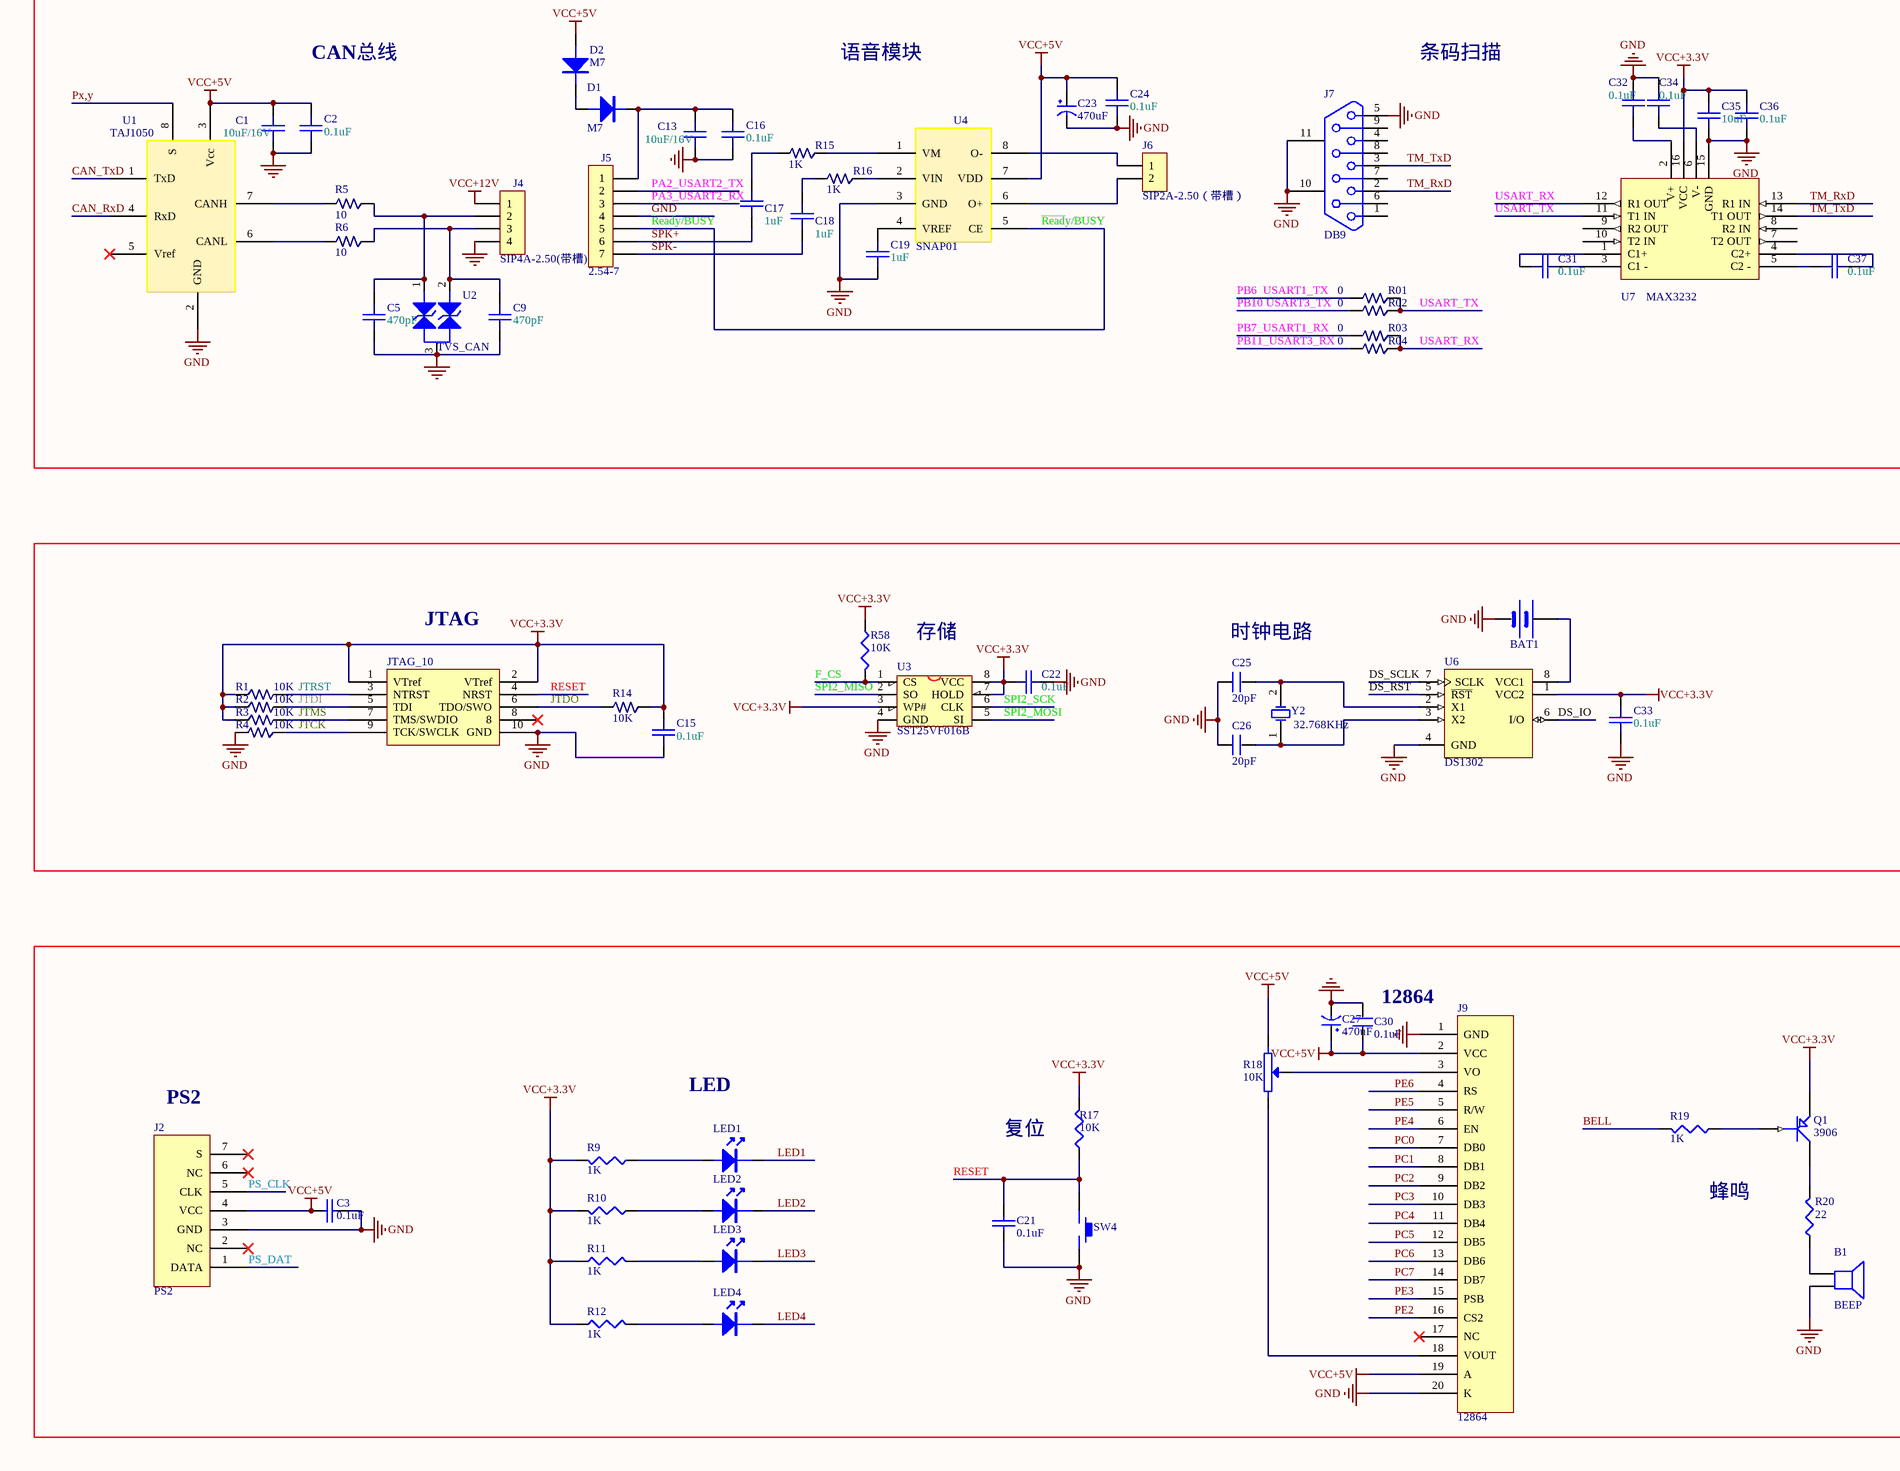
[diagram p7: 存储物柜V1.1.SchDoc, bottom left]
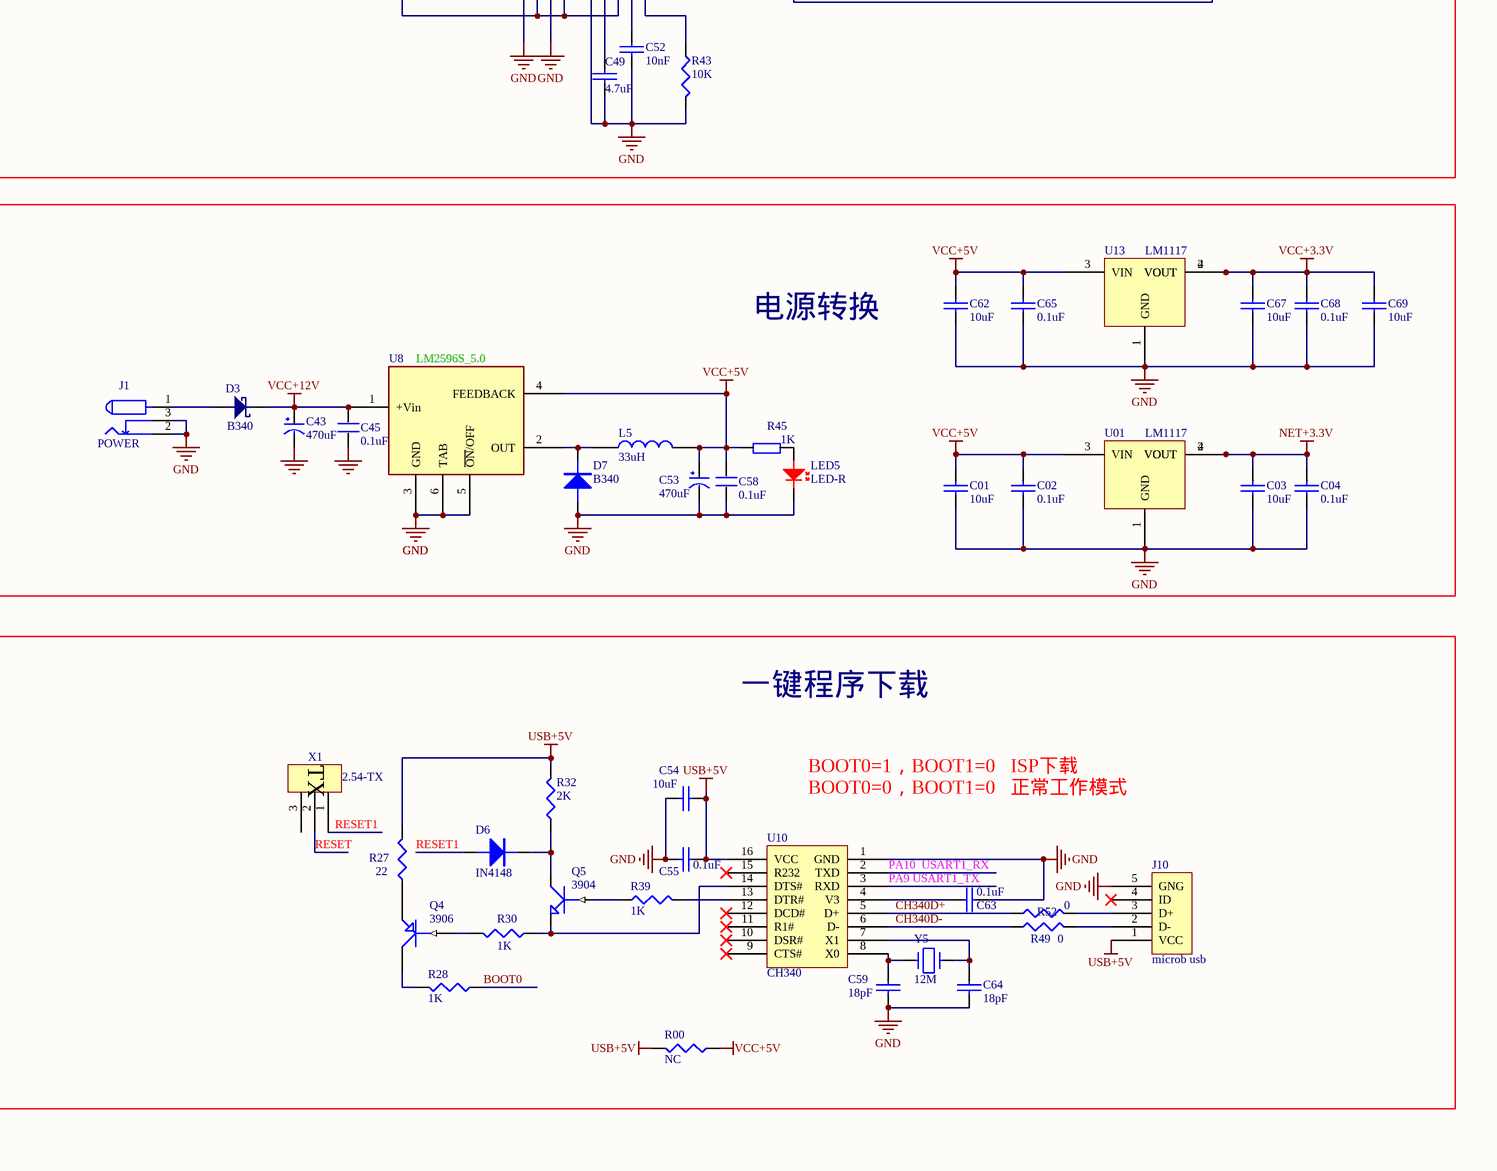
[diagram p8: 存储物柜V1.1.SchDoc, bottom right]

### Parts
(Parts that share a designator on the sheet are numbered #1, #2 ... from top to bottom, then left to right.)
B1#2  BEEP  [BEEP-12]
BAT1#2  BATT  [BATM]  (value not drawn)
C01  10uF  [0805]
C001  6.8nF  [0603]
C1#2  10uF/16V  [0805]
C02  0.1uF  [0603]
C002  6.8nF  [0603]
C2#2  0.1uF  [0603]
C03  10uF  [0805]
C003  10nF  [0603]
C3#2  0.1uF  [0603]
C04  0.1uF  [0603]
C004  10nF  [0603]
C4#2  10uF/25V  [0805]
C5#2  470pF  [0603]
C6#2  10uF/25V  [0805]
C7#2  18p  [0603]
C8#2  0.1uF  [0603]
C9#2  470pF  [0603]
C10#2  18p  [0603]
C11#2  0.1uF  [0603]
C12#2  0.1uF  [0603]
C13#2  10uF/16V  [0805]
C14#2  0.1uF  [0603]
C15#2  0.1uF  [0603]
C16#2  0.1uF  [0603]
C17#2  1uF  [0603]
C18#2  1uF  [0603]
C19#2  1uF  [0603]
C20#2  0.1uF  [0603]
C21#2  0.1uF  [0603]
C22#2  0.1uF  [0603]
C23#2  470uF  [RB5.0-8]
C24#2  0.1uF  [0603]
C25#2  20pF  [0603]
C26#2  20pF  [0603]
C27#2  470uF  [RB5.0-8]
C30#2  0.1uF  [0603]
C31#2  0.1uF  [0603]
C32#2  0.1uF  [0603]
C33#2  0.1uF  [0603]
C34#2  0.1uF  [0603]
C35#2  10uF  [0805]
C36#2  0.1uF  [0603]
C37#2  0.1uF  [0603]
C39#2  0.1uF  [0603]
C41#2  0.1uF  [0603]
C42#2  0.1uF  [0603]
C43#2  470uF  [RB5.0-8]
C45#2  0.1uF  [0603]
C46#2  0.1uF  [0603]
C47#2  0.1uF  [0603]
C48#2  NC  [0603]
C49#2  4.7uF  [0603]
C50#2  10uF  [0805]
C51#2  NC  [0603]
C52#2  10nF  [0603]
C53#2  470uF  [RB5.0-8]
C54#2  10uF  [0805]
C55#2  0.1uF  [0603]
C56#2  1000uF/6.3V  [7343]
C57#2  0.1uF  [0603]
C58#2  0.1uF  [0603]
C59#2  18pF  [0603]
C60#2  18p  [0603]
C61#2  18p  [0603]
C62#2  10uF  [0805]
C63#2  0.1uF  [0603]
C64#2  18pF  [0603]
C65#2  0.1uF  [0603]
C66#2  0.1uF  [0603]
C67#2  10uF  [0805]
C68#2  0.1uF  [0603]
C69#2  10uF  [0805]
D1#2  M7  [SMB]
D2#2  M7  [SMB]
D3#2  B340  [SMB]
D4#2  LED-R  [LED-0805]
D5#2  LED-R  [LED-0805]
D6#2  IN4148  [SOD-23]
D7#2  B340  [SMB]
D8#2  B340  [SMB]
D9#2  LED-R  [LED-0805]
J1#2  POWER  [DC10B]
J2#2  PS2  [PS2-6PIN]
J3#2  JTAG_10  [JTAG_10]
J4#2  SIP4A-2.50(带槽)  [5.08_4P]
J5#2  2.54-7  [SYN6288]
J6#2  SIP2A-2.50（带槽）  [2.54]
J7#2  DB9  [DB9/M]
J9#2  12864  [XH2.54-20P]
J10#2  microb usb  [USB_micro]
J11#2  HR911105A  [HR911105A]
K0  KEY_M  [KEY_M]  (value not drawn)
L1#2  100uH  [0805]
L2#2  100uH  [0805]
L3#2  100uH  [0805]
L4#2  100uH  [0805]
L5#2  33uH  [INDUCTOR-1212]
LED1#2  (no value)  [LED-0805]
LED2#2  (no value)  [LED-0805]
LED3#2  (no value)  [LED-0805]
LED4#2  (no value)  [LED-0805]
LED5#2  LED-R  [LED-0805]
P1#2  COAX-M  [ST-TH1]
Q1#2  3906  [SOT-23]
Q2#2  3904  [SOT-23]
Q3#2  3904  [SOT-23]
Q4#2  3906  [SOT-23]
Q5#2  3904  [SOT-23]
R00  NC  [1206]
R1#2  10K  [0603]
R01#2  0  [0603]
R2#2  10K  [0603]
R02#2  0  [0603]
R3#2  10K  [0603]
R03#2  0  [0603]
R4#2  10K  [0603]
R04#2  0  [0603]
R5#2  10  [0603]
R6#2  10  [0603]
R7#2  1M  [0603]
R8#2  10K  [0603]
R9#2  1K  [0603]
R10#2  1K  [0603]
R11#2  1K  [0603]
R12#2  1K  [0603]
R13#2  10K  [0603]
R14#2  10K  [0603]
R15#2  1K  [0603]
R16#2  1K  [0603]
R17#2  10K  [0603]
R18#2  10K  [RM065-V1]
R19#2  1K  [0603]
R20#2  22  [0603]
R21#2  1K  [0603]
R22#2  10K  [0603]
R23#2  1K  [0603]
R24#2  10K  [0603]
R25#2  1K  [0603]
R26#2  12.4K  [0603]
R27#2  22  [0603]
R28#2  1K  [0603]
R29#2  1K  [0603]
R30#2  1K  [0603]
R31#2  10K  [0603]
R32#2  2K  [0603]
R33#2  10K  [0603]
R34#2  0R  [0603]
R35#2  10K  [0603]
R36#2  10K  [0603]
R37#2  10K  [0603]
R38#2  10K  [0603]
R39#2  1K  [0603]
R40#2  10K  [0603]
R41#2  10K  [0603]
R42#2  10K  [0603]
R43#2  10K  [0603]
R44#2  1K  [0603]
R45#2  1K  [0603]
R46#2  10K  [0603]
R47#2  1M  [0603]
R48#2  10K  [0603]
R49#2  0  [0603]
R50#2  270  [0603]
R51#2  270  [0603]
R52#2  0  [0603]
R53#2  22  [0603]
R54#2  22  [0603]
R55#2  22  [0603]
R58  10K  [0603]
RN1  51R  [0603-4]
SW4#2  KEY_M  [KEY_M]  (value not drawn)
U01  LM1117  [AMS1117]
U1#2  TAJ1050  [SO-8]
U2#2  TVS_CAN  [SOT-23]
U3#2  SST25VF016B  [SOIC-8]
U4#2  SNAP01  [sop-8]
U5#2  STM32F103VET6  [LQFP100_N]
U6#2  DS1302  [SOP-8]
U7#2  MAX3232  [SOP16]
U8#2  LM2596S_5.0  [TO-263-5]
U9#2  W5500  [LQFP48_N]  (value not drawn)
U10#2  CH340  [SOP16]
U11#2  SIM900  [SIM-900]
U12#2  SIM  [sim-6p]
U13#2  LM1117  [AMS1117]
U14#2  SMF05  [SC70-6L]
X1  2.54-TX  [2.54-TX]
X2  2.54-TX  [2.54-TX]
Y1#2  8MHz  [XTAL_US]
Y2#2  32.768KHz  [cs-308]
Y4#2  25MHz  [XTAL_US]
Y5#2  12M  [XTAL_US]

### Blocks framed on the sheet
GSM模块部分: C47#2 C48#2 C50#2 C51#2 C56#2 C57#2 D4#2 D5#2 D8#2 D9#2 K0 P1#2 Q2#2 Q3#2 R21#2 R22#2 R23#2 R24#2 R25#2 R29#2 R34#2 R44#2 R53#2 R54#2 R55#2 U11#2 U12#2 U14#2 X2
网络部分: C001 C002 C003 C004 C39#2 C41#2 C42#2 C46#2 C49#2 C52#2 C60#2 C61#2 C66#2 J11#2 R26#2 R31#2 R33#2 R35#2 R36#2 R37#2 R38#2 R40#2 R41#2 R42#2 R43#2 R46#2 R47#2 R48#2 R50#2 R51#2 RN1 U9#2 Y4#2
电源转换: C01 C02 C03 C04 C43#2 C45#2 C53#2 C58#2 C62#2 C65#2 C67#2 C68#2 C69#2 D3#2 D7#2 J1#2 L5#2 LED5#2 R45#2 U01 U8#2 U13#2
一键程序下载: C54#2 C55#2 C59#2 C63#2 C64#2 D6#2 J10#2 Q4#2 Q5#2 R00 R27#2 R28#2 R30#2 R32#2 R39#2 R49#2 R52#2 U10#2 X1 Y5#2

### Nets
GND: B1#2.2 BAT1#2.2(GND) C01.1 C01.2 C1#2.1 C1#2.2 C02.1 C02.2 C2#2.1 C2#2.2 C03.2 C003.2 C3#2.1 C3#2.2 C04.2 C004.2 C4#2.1 C5#2.2 C6#2.1 C7#2.2 C8#2.1 C9#2.2 C10#2.2 C11#2.1 C12#2.1 C13#2.1 C15#2.2 C16#2.1 C19#2.2 C21#2.2 C22#2.2 C23#2.1(VCC) C23#2.2(GND) C24#2.1 C24#2.2 C25#2.1 C26#2.1 C27#2.1(VCC) C27#2.2(GND) C30#2.1 C30#2.2 C32#2.2 C33#2.1 C34#2.2 C35#2.1 C36#2.1 C39#2.2 C41#2.2 C42#2.2 C43#2.2(GND) C45#2.1 C46#2.2 C47#2.1 C48#2.2 C49#2.1 C50#2.2(GND) C51#2.2 C52#2.2 C53#2.1(VCC) C53#2.2(GND) C54#2.1 C55#2.1 C56#2.2(GND) C57#2.2 C58#2.1 C58#2.2 C59#2.1 C60#2.1 C61#2.1 C62#2.1 C62#2.2 C63#2.1 C64#2.2 C65#2.1 C65#2.2 C66#2.2 C67#2.2 C68#2.2 C69#2.2 D2#2.1(A) D4#2.2 D5#2.2 D7#2.1(A) D8#2.1(A) D9#2.2 J1#2.2 J1#2.3 J2#2.3(GND) J2#2.4(VCC) J3#2.10(GND) J4#2.4 J5#2.4 J7#2.5 J7#2.10 J7#2.11 J9#2.1(GND) J9#2.2(VCC) J9#2.19(A) J9#2.20(K) J10#2.5(GNG) J11#2.13 J11#2.14 K0.2 L1#2.1 L4#2.1 L5#2.2 LED5#2.2 P1#2.2(GND) Q2#2.2(E) Q3#2.2(E) R00.1 R4#2.2 R8#2.2 R13#2.2 R18#2.1 R22#2.1 R24#2.1 R26#2.1 R36#2.1 R37#2.1 R38#2.1 R40#2.1 R41#2.1 R43#2.2 R45#2.1 SW4#2.2 U01.1(GND) U01.3(VIN) U1#2.2(GND) U1#2.3(Vcc) U2#2.3 U3#2.4(GND) U4#2.3(GND) U4#2.7(VDD) U5#2.10(VSS_5) U5#2.27(VSS_4) U5#2.49(VSS_1) U5#2.74(VSS_2) U5#2.99(VSS_3) U6#2.4(GND) U7#2.15(GND) U8#2.3(GND) U8#2.4(FEEDBACK) U8#2.5(~{ON}/OFF) U8#2.6(TAB) U9#2.3(AGND) U9#2.9(AGND) U9#2.14(AGND) U9#2.16(AGND) U9#2.19(VGND) U9#2.29(GND) U9#2.48(AGND) U10#2.1(GND) U11#2.18(GND) U11#2.29(GND) U11#2.39(GND) U11#2.45(GND) U11#2.46(GND) U11#2.53(GND) U11#2.54(GND) U11#2.58(GND) U11#2.59(GND) U11#2.61(GND) U11#2.62(GND) U11#2.63(GND) U11#2.64(GND) U11#2.65(GND) U12#2.3(GND) U13#2.1(GND) U13#2.3(VIN) U14#2.2  [also labelled VCC+5V]
NET+3.3V: C03.1 C04.1 C004.1 C39#2.1 C41#2.1 C42#2.1 C46#2.1 C66#2.1 J11#2.4 J11#2.5 R31#2.1 R33#2.1 R35#2.1 R42#2.1 R46#2.1 R48#2.1 R50#2.1 R51#2.1 RN1.1 RN1.3 U01.2(VOUT) U01.4(VOUT) U9#2.4(AVDD) U9#2.8(AVDD) U9#2.11(AVDD) U9#2.15(AVDD) U9#2.17(AVDD) U9#2.21(AVDD) U9#2.28(VDD)
USB+5V: C54#2.2 C55#2.2 J10#2.1(VCC) R00.2 R27#2.2 R32#2.2 U10#2.16(VCC)
VCC+3.3V: C4#2.2 C6#2.2 C8#2.2 C11#2.2 C12#2.2 C15#2.1 C22#2.1 C33#2.2 C35#2.2 C36#2.2 C67#2.1 C68#2.1 C69#2.1 J3#2.1(VTref) J3#2.2(VTref) L2#2.1 L3#2.2 Q1#2.2(E) R1#2.1 R2#2.1 R3#2.1 R9#2.2 R10#2.2 R11#2.1 R12#2.1 R14#2.1 R17#2.2 R58.1 U3#2.3(WP#) U3#2.7(HOLD) U3#2.8(VCC) U5#2.11(VDD_5) U5#2.28(VDD_4) U5#2.50(VDD_1) U5#2.75(VDD_2) U5#2.100(VDD_3) U6#2.1(VCC2) U7#2.16(VCC) U13#2.2(VOUT) U13#2.4(VOUT)
VCC+12V: C43#2.1(VCC) C45#2.2 D3#2.2 J4#2.1 U8#2.1(+Vin)
BELL: R19#2.2 U5#2.64(PC7/TIM3_CH2)
BOOT0: R13#2.1 R28#2.1 U5#2.94(BOOT0)
BOOT1: R8#2.1 U5#2.37(PB2/BOOT1)
CAN_RxD: U1#2.4(RxD) U5#2.95(PB8/TIM4_CH3/I2C1_SCL/CAN_RX)
CAN_TxD: U1#2.1(TxD) U5#2.96(PB9/TIM4_CH4/I2C1_SDA/CAN_TX)
CH340D+: R52#2.1 U10#2.5(D+)
CH340D-: R49#2.1 U10#2.6(D-)
DS_IO: U5#2.58(PD11/USART3_CTS) U6#2.6(I/O)
DS_RST: U5#2.59(PD12/TIM4_CH1/USART3_RTS) U6#2.5(~{RST})
DS_SCLK: U5#2.57(PD10/USART3_CK) U6#2.7(SCLK)
F_CS: R58.2 U3#2.1(CS) U5#2.51(PB12/SPI2_NSS/I2C2_SMBAI/USART3_CK/TIM1_BKIN)
JTCK: J3#2.9(TCK/SWCLK) R4#2.1 U5#2.76(PA14/JTCK/SWCLK)
JTDI: J3#2.5(TDI) R2#2.2 U5#2.77(PA15/JTDI)
JTDO: J3#2.6(TDO/SWO) R14#2.2 U5#2.89(PB3/JTDO)
JTMS: J3#2.7(TMS/SWDIO) R3#2.2 U5#2.72(PA13/JTMS/SWDIO)
JTRST: J3#2.3(NTRST) R1#2.2 U5#2.90(PB4/JNTRST)
LED1: LED1#2.2 U5#2.60(PD13/TIM4_CH2)
LED2: LED2#2.2 U5#2.61(PD14/TIM4_CH3)
LED3: LED3#2.2 U5#2.62(PD15/TIM4_CH4)
LED4: LED4#2.2 U5#2.63(PC6/TIM3_CH1)
NET_CS: R48#2.2 U5#2.29(PA4/SPI1_NSS/USART2_CK/ADC4) U9#2.32(SCSn)
NET_INT: R46#2.2 U5#2.24(PA1/USART2_RTS/ADC1/TIM2_CH2) U9#2.36(INTn)
NET_RST: R42#2.2 U5#2.23(PA0-WKUP/USART2_CTS/ADC0/TIM2_CH1_ETR) U9#2.37(RSTn)
OSC_IN: C7#2.1 R7#2.1 U5#2.12(OSC_IN) Y1#2.1(OSC1)
OSC_OUT: C10#2.1 R7#2.2 U5#2.13(OSC_OUT) Y1#2.2(OSC2)
PA2_USART2_TX: J5#2.2 U5#2.25(PA2/USART2_TX/ADC2/TIM2_CH3)
PA3_USART2_RX: J5#2.3 U5#2.26(PA3/USART2_RX/ADC3/TIM2_CH4)
PA9 USART1_TX: U5#2.68(PA9/USART1_TX/TIM1_CH2) U10#2.3(RXD)
PA10  USART1_RX: U5#2.69(PA10/USART1_RX/TIM1_CH3) U10#2.2(TXD)
PB6  USART1_TX: R01#2.2 U5#2.92(PB6/I2C1_SCL/TIM4_CH1/USART1_TX)
PB7_USART1_RX: R03#2.2 U5#2.93(PB7/I2C1_SDA/TIM4_CH2/USART1_RX)
PB10 USART3_TX: R02#2.2 U5#2.47(PB10/I2C2_SCL/USART3_TX/TIM2_CH3)
PB11_USART3_RX: R04#2.2 U5#2.48(PB11/I2C2_SDA/USART3_RX/TIM2_CH4)
PC0: J9#2.7(DB0) U5#2.39(PE8/TIM1_CH1N)
PC1: J9#2.8(DB1) U5#2.40(PE9/TIM1_CH1)
PC2: J9#2.9(DB2) U5#2.41(PE10/TIM1_CH2N)
PC3: J9#2.10(DB3) U5#2.42(PE11/TIM1_CH2)
PC4: J9#2.11(DB4) U5#2.43(PE12/TIM1_CH3N)
PC5: J9#2.12(DB5) U5#2.44(PE13/TIM1_CH3)
PC6: J9#2.13(DB6) U5#2.45(PE14/TIM1_CH4)
PC7: J9#2.14(DB7) U5#2.46(PE15/TIM1_BKIN)
PC10 USART3_TX: U5#2.78(PC10/USART3_TX) U11#2.10(RXD_I)
PC11 USART3_RX: U5#2.79(PC11/USART3_RX) U11#2.9(TXD_O)
PE2: J9#2.16(CS2) U5#2.1(PE2)
PE3: J9#2.15(PSB) U5#2.2(PE3)
PE4: J9#2.6(EN) U5#2.3(PE4)
PE5: J9#2.5(R/W) U5#2.4(PE5)
PE6: J9#2.4(RS) U5#2.5(PE6)
PS_CLK: J2#2.5(CLK) U5#2.36(PB1/ADC9/TIM3_CH4/TIM1_CH3N)
PS_DAT: J2#2.1(DATA) U5#2.35(PB0/ADC8/TIM3_CH3/TIM1_CH2N)
PWRKEY: K0.1 Q2#2.3(C) U11#2.1(PWRKEY)
Px,y: U1#2.8(S)
~{Read}y/BUSY: J5#2.5 U4#2.5(CE) U5#2.18(PC3/ADC13)
RESET: C21#2.1 J3#2.4(NRST) R17#2.1 SW4#2.1 U5#2.14(NRST) X1.2
RESET1: D6#2.1(A) X1.1
RXN: C002.2 RN1.8 U9#2.5(RXN)
RXP: C001.2 RN1.6 U9#2.6(RXP)
SIM900_RST: R23#2.1 U5#2.66(PC9/TIM3_CH4)
SIM_CLK: R55#2.2 U11#2.32(SIM_CLK)
SIM_DATA: R53#2.2 U11#2.31(SIM_DATA)
SIM_PWRKEY: U5#2.65(PC8/TIM3_CH3) X2.1
SIM_RST: R54#2.2 U11#2.33(SIM_RST)
SIM_VDD: U11#2.30(SIM_VDD) U12#2.6(VCC) U14#2.4
SPI1_MISO: U5#2.31(PA6/SPI1_MISO/ADC6/TIM3_CH1/TIM1_BKIN) U9#2.34(MISO)
SPI1_MOSI: U5#2.32(PA7/SPI1_MOSI/ADC7/TIM3_CH2/TIM1_CH1N) U9#2.35(MOSI)
SPI1_SCK: U5#2.30(PA5/SPI1_SCK/ADC5) U9#2.33(SCLK)
SPI2_MISO: U3#2.2(SO) U5#2.53(PB14/SPI2_MISO/USART3_RTS/TIM1_CH2N)
SPI2_MOSI: U3#2.5(SI) U5#2.54(PB15/SPI2_MOSI/TIM1_CH3N)
SPI2_SCK: U3#2.6(CLK) U5#2.52(PB13/SPI2_SCK/USART3_CTS/TIM1CH1N)
SPK+: C17#2.1 J5#2.6
SPK-: C18#2.1 J5#2.7
TM_RxD: J7#2.2 U7#2.13(R1_IN)
TM_TxD: J7#2.3 U7#2.14(T1_OUT)
TXN: J11#2.2(TD-) RN1.4 U9#2.1(TXN)
TXP: J11#2.1(TD+) RN1.2 U9#2.2(TXP)
USART_RX: R03#2.1 R04#2.1 U7#2.12(R1_OUT)
USART_TX: R01#2.1 R02#2.1 U7#2.11(T1_IN)
NetB1#2_1: B1#2.1 R20#2.1
NetBAT1#2_1: BAT1#2.1(VCC) U6#2.8(VCC1)
NetC001_1: C001.1 J11#2.3(RD+)
NetC002_1: C002.1 J11#2.6(RD-)
NetC003_1: C003.1 RN1.5 RN1.7
NetC5#2_1: C5#2.1 J4#2.2 R5#2.1 U2#2.1
NetC9#2_1: C9#2.1 J4#2.3 R6#2.1 U2#2.2(K)
NetC13#2_2: C13#2.2 C16#2.2 D1#2.2(K) J5#2.1
NetC14#2_1: C14#2.1 L1#2.2 U5#2.20(VREF-)
NetC14#2_2: C14#2.2 L2#2.2 U5#2.21(VREF+)
NetC17#2_2: C17#2.2 R15#2.2
NetC18#2_2: C18#2.2 R16#2.2
NetC19#2_1: C19#2.1 U4#2.4(VREF)
NetC20#2_1: C20#2.1 L3#2.1 U5#2.22(VDDA)
NetC20#2_2: C20#2.2 L4#2.2 U5#2.19(VSSA)
NetC25#2_2: C25#2.2 U6#2.2(X1) Y2#2.2(OSC2)
NetC26#2_2: C26#2.2 U6#2.3(X2) Y2#2.1(OSC1)
NetC31#2_1: C31#2.1 U7#2.1(C1+)
NetC31#2_2: C31#2.2 U7#2.3(C1_-)
NetC32#2_1: C32#2.1 U7#2.2(V+)
NetC34#2_1: C34#2.1 U7#2.6(V-)
NetC37#2_1: C37#2.1 U7#2.5(C2_-)
NetC37#2_2: C37#2.2 U7#2.4(C2+)
NetC47#2_2: C47#2.2 Q3#2.3(C) U11#2.16(~{nRESET})
NetC48#2_1: C48#2.1 P1#2.1(Signal) R34#2.1
NetC49#2_2: C49#2.2 U9#2.20(TOCAP)
NetC50#2_1: C50#2.1(VCC) U11#2.26(VRTC)
NetC51#2_1: C51#2.1 R34#2.2 U11#2.60(RF)
NetC52#2_1: C52#2.1 U9#2.22(1V2O)
NetC56#2_1: C56#2.1(VCC) C57#2.1 D8#2.2(K) U11#2.55(VBAT) U11#2.56(VBAT) U11#2.57(VBAT)
NetC59#2_2: C59#2.2 U10#2.8(X0) Y5#2.1
NetC60#2_2: C60#2.2 R47#2.1 U9#2.30(XI/CLKIN) Y4#2.1(OSC1)
NetC61#2_2: C61#2.2 R47#2.2 U9#2.31(XO) Y4#2.2(OSC2)
NetC63#2_2: C63#2.2 U10#2.4(V3)
NetC64#2_1: C64#2.1 U10#2.7(X1) Y5#2.2
NetD1#2_1: D1#2.1(A) D2#2.2(K)
NetD3#2_1: D3#2.1 J1#2.1
NetD4#2_1: D4#2.1 R25#2.1
NetD5#2_1: D5#2.1 R29#2.1
NetD6#2_2: D6#2.2(K) Q5#2.3(C) R32#2.1
NetD7#2_2: D7#2.2(K) L5#2.1 U8#2.2(OUT)
NetD9#2_1: D9#2.1 R44#2.1
NetJ6#2_1: J6#2.1 U4#2.8(O-)
NetJ6#2_2: J6#2.2 U4#2.6(O+)
NetJ9#2_3: J9#2.3(VO) R18#2.2
NetJ9#2_18: J9#2.18(VOUT) R18#2.3
NetJ10#2_2: J10#2.2(D-) R49#2.2
NetJ10#2_3: J10#2.3(D+) R52#2.2
NetJ11#2_9: J11#2.9(L+) R50#2.2
NetJ11#2_10: J11#2.10(L-) U9#2.25(LINKLED)
NetJ11#2_11: J11#2.11(R-) U9#2.27(ACTLED)
NetJ11#2_12: J11#2.12(R+) R51#2.2
NetLED1#2_1: LED1#2.1 R9#2.1
NetLED2#2_1: LED2#2.1 R10#2.1
NetLED3#2_1: LED3#2.1 R11#2.2
NetLED4#2_1: LED4#2.1 R12#2.2
NetLED5#2_1: LED5#2.1 R45#2.2
NetQ1#2_1: Q1#2.1(B) R19#2.1
NetQ1#2_3: Q1#2.3(C) R20#2.2
NetQ2#2_1: Q2#2.1(B) R21#2.2 R22#2.2
NetQ3#2_1: Q3#2.1(B) R23#2.2 R24#2.2
NetQ4#2_1: Q4#2.1(B) R30#2.2
NetQ4#2_2: Q4#2.2(E) R27#2.1
NetQ4#2_3: Q4#2.3(C) R28#2.2
NetQ5#2_1: Q5#2.1(B) R39#2.1
NetQ5#2_2: Q5#2.2(E) R30#2.1 U10#2.14(DTS#)
NetR5#2_2: R5#2.2 U1#2.7(CANH)
NetR6#2_2: R6#2.2 U1#2.6(CANL)
NetR15#2_1: R15#2.1 U4#2.1(VM)
NetR16#2_1: R16#2.1 U4#2.2(VIN)
NetR21#2_1: R21#2.1 X2.2
NetR25#2_2: R25#2.2 U11#2.4(RI)
NetR26#2_2: R26#2.2 U9#2.10(EXRES1)
NetR29#2_2: R29#2.2 U11#2.66(STATUS)
NetR31#2_2: R31#2.2 U9#2.45(PMODE0)
NetR33#2_2: R33#2.2 U9#2.44(PMODE1)
NetR35#2_2: R35#2.2 U9#2.43(PMODE2)
NetR36#2_2: R36#2.2 U9#2.42(RSVD)
NetR37#2_2: R37#2.2 U9#2.41(RSVD)
NetR38#2_2: R38#2.2 U9#2.40(RSVD)
NetR39#2_2: R39#2.2 U10#2.13(DTR#)
NetR40#2_2: R40#2.2 U9#2.39(RSVD)
NetR41#2_2: R41#2.2 U9#2.38(RSVD)
NetR43#2_1: R43#2.1 U9#2.23(RSVD)
NetR44#2_2: R44#2.2 U11#2.52(netLED)
NetR53#2_1: R53#2.1 U12#2.1(I/O) U14#2.1
NetR54#2_1: R54#2.1 U12#2.5(RST) U14#2.5
NetR55#2_1: R55#2.1 U12#2.4(CLK) U14#2.6

Not connected (* = marked no-connect by the designer): J2#2 2(NC)* 6(NC)* 7(S)*; J3#2 8*; J7#2 1 4 6 7 8 9; J9#2 17(NC)*; J10#2 4(ID)*; J11#2 7* 8*; P1#2 3(GND) 4(GND) 5(GND); U1#2 5(Vref)*; U5#2 6(VBAT)* 7(PC13-TAMPER-RTC)* 8(PC14-OSC32_IN)* 9(PC15-OSC32_OUT)* 15(PC0/AD10)* 16(PC1/ADC11)* 17(PC2/ADC12)* 33(PC4/ADC14)* 34(PC5/ADC15)* 38(PE7/TIM1_ETR)* 55(PD8/USART3_TX) 56(PD9/USART3_RX) 67(PA8/USART1_CK/TIM1_CH1/MCO)* 70(PA11/USART1_CTS/USBDM/CAN_RX/TIM1_CH4)* 71(PA12/USART1_RTS/USBDP/CAN_TX/TIM1_ETR)* 73(NC)* 80(PC12/USART3_CK)* 81(PD0/OSC_IN/CAN_RX)* 82(PD1/OSC_OUT/CAN_TX)* 83(PD2/TIM3_ETR)* 84(PD3/USART2_CTS)* 85(PD4/USART2_RTS)* 86(PD5/USART2_TX)* 87(PD6/USART2_RX)* 88(PD7/USART2_CK)* 91(PB5/I2C1_SMBAI/TIM3_CH2/SPI1_MOSI)* 97(PE0/TIM4_ETR)* 98(PE1)*; U7#2 7(T2_OUT) 8(R2_IN) 9(R2_OUT) 10(T2_IN); U9#2 7(DNC)* 12(NC)* 13(NC)* 18(VBG)* 24(SPDLED)* 26(DUPLED)* 46(NC)* 47(NC)*; U10#2 9(CTS#)* 10(DSR#)* 11(R1#)* 12(DCD#)* 15(R232)*; U11#2 2(PWRKEYOUT)* 3(DTR)* 5(DCD)* 6(DSR)* 7(CTS)* 8(RTS)* 11(DISP_CLK)* 12(DISP_DATA)* 13(DISP_D/C)* 14(DISP_CS)* 15(VDD_EXT)* 17(GND) 19(MICP)* 20(MICN)* 21(SPP)* 22(SPN)* 23(LINE_R)* 24(LINE_L)* 25(ADC)* 27(DBG_TXD)* 28(DBG_RXD)* 34(SIM_PRES)* 35(PWM1)* 36(PWM2)* 37(SDA)* 38(SCL)* 40(GPIO1/KBR4)* 41(GPIO2/KBR3)* 42(GPIO3/KBR2)* 43(GPIO4/KBR1)* 44(GPIO5/KBR0)* 47(GPIO6/KBC4)* 48(GPIO7/KBC3)* 49(GPIO8/KBC2)* 50(GPIO9/KBC1)* 51(GPIO10/KBC0)* 67(GPIO11)* 68(GPIO12)*; U12#2 2(VPP)*; U14#2 3*; X1 3; X2 3

### Notes on the sheet
- (near R53#2) SIM900A
  单电压：3.2V-4.8V ；
  Vnorm=4.0V；
  电流：≥2A；
  增加手动开关机；
- CAN总线
- 语音模块
- 条码扫描
- JTAG
- 存储
- (near C25#2) 时钟电路
- BOOT0=1，BOOT1=0   ISP下载
  BOOT0=0，BOOT1=0   正常工作模式
- (near C30#2) 12864
- (near J2#2) PS2
- LED
- 复位
- 蜂鸣
- Labels drawn without touching a wire or pin: SIM900_TXD
- (in symbol 2.54-TX) TX

### Library data of the parts
B1#2 = SPEAKER
BAT1#2 = BAT
C01 C02 C03 C003 C3#2 C04 C004 C4#2 C6#2 C8#2 C11#2 C12#2 C14#2 C20#2 C21#2 C23#2 C27#2 C39#2 C41#2 C42#2 C43#2 C46#2 C50#2 C52#2 C53#2 C55#2 C56#2 C62#2 C63#2 C65#2 C66#2 C67#2 C68#2 C69#2 = CAP
C001 C002 C25#2 C26#2 C30#2 C45#2 C47#2 C48#2 C51#2 C57#2 C58#2 C60#2 C61#2 = C
C1#2 C2#2 C5#2 C7#2 C9#2 C10#2 C13#2 C15#2 C16#2 C17#2 C18#2 C19#2 C22#2 C24#2 C31#2 C32#2 C33#2 C34#2 C35#2 C36#2 C37#2 = CAP: 陶瓷电容
C49#2 C54#2 C59#2 C64#2 = CAP: 0.1uF
D1#2 D2#2 D6#2 D7#2 D8#2 = DIODE
D3#2 = 1N5824(SS54): 肖特基二极管
D4#2 D5#2 D9#2 LED5#2 = LED-RED: 红色LED
J1#2 = POW
L1#2 L2#2 L3#2 L4#2 L5#2 = INDUCTOR
LED1#2 LED2#2 LED3#2 LED4#2 = LED
P1#2 = COAX-M: as P1#1 on sheet gsm_sim900; Published: 15-Jul-2004; LatestRevisionDate: 15-Jul-2004; LatestRevisionNote: Component Replaced.; DatasheetDocument: 30-May-2003; PackageReference: 908-21103; Publisher: Altium Limited; ComponentLink1Description: Manufacturer Link; ComponentLink1URL: http://www.amphenolrf.com/
Q1#2 Q4#2 = PNP1
Q2#2 Q3#2 Q5#2 = NPN1
R00 R8#2 R9#2 R10#2 R11#2 R12#2 R13#2 R17#2 R19#2 R20#2 R26#2 R27#2 R28#2 R29#2 R30#2 R31#2 R32#2 R33#2 R35#2 R36#2 R37#2 R38#2 R39#2 R40#2 R41#2 R42#2 R43#2 R44#2 R46#2 R47#2 R48#2 R49#2 R50#2 R51#2 R52#2 R53#2 R54#2 R55#2 R58 = RES1
R1#2 R01#2 R2#2 R02#2 R3#2 R03#2 R4#2 R04#2 R5#2 R6#2 R7#2 R14#2 R15#2 R16#2 = RES-1%: 高精度电阻
R18#2 = POT2
R21#2 R22#2 R23#2 R24#2 R25#2 R34#2 R45#2 = Res
RN1 = RESPACK
U2#2 = TVS_CAN: NUP2105L
U3#2 = W25X16: W25X16;SST25VF016;MX25L1605
U5#2 = STM32F103VET6: as U5#1 on sheet cpu; Published: 30-May-2008; DatasheetVersion: rev6, Mar-2008; PackageVersion: Mar-2008; PackageReference: LQFP100; Publisher: Altium Limited; PackageDescription: 100-Pin Low-Profile Quad Flat Pack, 14 x 14 mm Body, 0.5 mm Pitch (LQFP100); ComponentLink1Description: Manufacturer Link; ComponentLink1URL: www.st.com/stm32; ComponentLink2Description: Datasheet; ComponentLink2URL: http://www.st.com/stonline/products/literature/ds/13587.pdf
U6#2 = DS1302: 实时时钟
U7#2 = MAX232
U8#2 = LM2596S_5.0: 3A开关电源芯片
U9#2 = W5500: 以太网
U12#2 = SIM: 手机SIM卡
Y1#2 Y2#2 Y4#2 = XTAL: Crystal Oscillator; Published: 8-Jun-2000; LatestRevisionDate: 17-Jul-2002; LatestRevisionNote: Re-released for DXP Platform.; Publisher: Altium Limited
Y5#2 = CRYSTAL

## Nets that join several sheets
GND: cpu (18 pins), other (55 pins), power&down (38 pins), net_w5500 (28 pins), gsm_sim900 (31 pins), 存储物柜V1.1 (171 pins)
VCC+3.3V: cpu (12 pins), other (22 pins), power&down (5 pins), net_w5500 (25 pins), 存储物柜V1.1 (40 pins)
VCC+12V: other (J4#1.1), power&down (D3#1.1 J1#1.1), 存储物柜V1.1 (5 pins)
BELL: cpu (U5#1.64), other (R19#1.2), 存储物柜V1.1 (R19#2.2 U5#2.64)
BOOT0: cpu (R13#1.1 U5#1.94), power&down (R28#1.1), 存储物柜V1.1 (R13#2.1 R28#2.1 U5#2.94)
BOOT1: cpu (R8#1.1 U5#1.37), 存储物柜V1.1 (R8#2.1 U5#2.37)
CAN_RxD: cpu (U5#1.95), other (U1#1.4), 存储物柜V1.1 (U1#2.4 U5#2.95)
CAN_TxD: cpu (U5#1.96), other (U1#1.1), 存储物柜V1.1 (U1#2.1 U5#2.96)
CH340D+: power&down (R52#1.1 U10#1.5), 存储物柜V1.1 (R52#2.1 U10#2.5)
CH340D-: power&down (R49#1.1 U10#1.6), 存储物柜V1.1 (R49#2.1 U10#2.6)
DS_IO: cpu (U5#1.58), other (U6#1.6), 存储物柜V1.1 (U5#2.58 U6#2.6)
DS_RST: cpu (U5#1.59), other (U6#1.5), 存储物柜V1.1 (U5#2.59 U6#2.5)
DS_SCLK: cpu (U5#1.57), other (U6#1.7), 存储物柜V1.1 (U5#2.57 U6#2.7)
F_CS: cpu (U5#1.51), other (U3#1.1), 存储物柜V1.1 (R58.2 U3#2.1 U5#2.51)
JTCK: cpu (U5#1.76), other (J3#1.9 R4#1.1), 存储物柜V1.1 (J3#2.9 R4#2.1 U5#2.76)
JTDI: cpu (U5#1.77), other (J3#1.5 R2#1.2), 存储物柜V1.1 (J3#2.5 R2#2.2 U5#2.77)
JTDO: cpu (U5#1.89), other (J3#1.6 R14#1.2), 存储物柜V1.1 (J3#2.6 R14#2.2 U5#2.89)
JTMS: cpu (U5#1.72), other (J3#1.7 R3#1.2), 存储物柜V1.1 (J3#2.7 R3#2.2 U5#2.72)
JTRST: cpu (U5#1.90), other (J3#1.3 R1#1.2), 存储物柜V1.1 (J3#2.3 R1#2.2 U5#2.90)
LED1: cpu (U5#1.60), other (LED1#1.2), 存储物柜V1.1 (LED1#2.2 U5#2.60)
LED2: cpu (U5#1.61), other (LED2#1.2), 存储物柜V1.1 (LED2#2.2 U5#2.61)
LED3: cpu (U5#1.62), other (LED3#1.2), 存储物柜V1.1 (LED3#2.2 U5#2.62)
LED4: cpu (U5#1.63), other (LED4#1.2), 存储物柜V1.1 (LED4#2.2 U5#2.63)
NET_CS: cpu (U5#1.29), net_w5500 (R48#1.2 U9#1.32), 存储物柜V1.1 (R48#2.2 U5#2.29 U9#2.32)
NET_INT: cpu (U5#1.24), net_w5500 (R46#1.2 U9#1.36), 存储物柜V1.1 (R46#2.2 U5#2.24 U9#2.36)
NET_RST: cpu (U5#1.23), net_w5500 (R42#1.2 U9#1.37), 存储物柜V1.1 (R42#2.2 U5#2.23 U9#2.37)
OSC_IN: cpu (C7#1.1 R7#1.1 U5#1.12 Y1#1.1), 存储物柜V1.1 (C7#2.1 R7#2.1 U5#2.12 Y1#2.1)
OSC_OUT: cpu (C10#1.1 R7#1.2 U5#1.13 Y1#1.2), 存储物柜V1.1 (C10#2.1 R7#2.2 U5#2.13 Y1#2.2)
PA2_USART2_TX: cpu (U5#1.25), other (J5#1.2), 存储物柜V1.1 (J5#2.2 U5#2.25)
PA3_USART2_RX: cpu (U5#1.26), other (J5#1.3), 存储物柜V1.1 (J5#2.3 U5#2.26)
PA9 USART1_TX: cpu (U5#1.68), power&down (U10#1.3), 存储物柜V1.1 (U5#2.68 U10#2.3)
PA10  USART1_RX: cpu (U5#1.69), power&down (U10#1.2), 存储物柜V1.1 (U5#2.69 U10#2.2)
PB6  USART1_TX: cpu (U5#1.92), other (R01#1.2), 存储物柜V1.1 (R01#2.2 U5#2.92)
PB7_USART1_RX: cpu (U5#1.93), other (R03#1.2), 存储物柜V1.1 (R03#2.2 U5#2.93)
PB10 USART3_TX: cpu (U5#1.47), other (R02#1.2), 存储物柜V1.1 (R02#2.2 U5#2.47)
PB11_USART3_RX: cpu (U5#1.48), other (R04#1.2), 存储物柜V1.1 (R04#2.2 U5#2.48)
PC0: cpu (U5#1.39), other (J9#1.7), 存储物柜V1.1 (J9#2.7 U5#2.39)
PC1: cpu (U5#1.40), other (J9#1.8), 存储物柜V1.1 (J9#2.8 U5#2.40)
PC2: cpu (U5#1.41), other (J9#1.9), 存储物柜V1.1 (J9#2.9 U5#2.41)
PC3: cpu (U5#1.42), other (J9#1.10), 存储物柜V1.1 (J9#2.10 U5#2.42)
PC4: cpu (U5#1.43), other (J9#1.11), 存储物柜V1.1 (J9#2.11 U5#2.43)
PC5: cpu (U5#1.44), other (J9#1.12), 存储物柜V1.1 (J9#2.12 U5#2.44)
PC6: cpu (U5#1.45), other (J9#1.13), 存储物柜V1.1 (J9#2.13 U5#2.45)
PC7: cpu (U5#1.46), other (J9#1.14), 存储物柜V1.1 (J9#2.14 U5#2.46)
PC10 USART3_TX: cpu (U5#1.78), gsm_sim900 (U11#1.10), 存储物柜V1.1 (U5#2.78 U11#2.10)
PC11 USART3_RX: cpu (U5#1.79), gsm_sim900 (U11#1.9), 存储物柜V1.1 (U5#2.79 U11#2.9)
PE2: cpu (U5#1.1), other (J9#1.4), 存储物柜V1.1 (J9#2.16 U5#2.1)
PE3: cpu (U5#1.2), other (J9#1.5), 存储物柜V1.1 (J9#2.15 U5#2.2)
PE4: cpu (U5#1.3), other (J9#1.6), 存储物柜V1.1 (J9#2.6 U5#2.3)
PE5: cpu (U5#1.4), other (J9#1.15), 存储物柜V1.1 (J9#2.5 U5#2.4)
PE6: cpu (U5#1.5), other (J9#1.16), 存储物柜V1.1 (J9#2.4 U5#2.5)
PS_CLK: cpu (U5#1.36), other (J2#1.5), 存储物柜V1.1 (J2#2.5 U5#2.36)
PS_DAT: cpu (U5#1.35), other (J2#1.1), 存储物柜V1.1 (J2#2.1 U5#2.35)
PWRKEY: gsm_sim900 (Q2#1.3 U11#1.1), 存储物柜V1.1 (K0.1 Q2#2.3 U11#2.1)
Px,y: other (U1#1.8), 存储物柜V1.1 (U1#2.8)
~{Read}y/BUSY: cpu (U5#1.18), other (J5#1.5 U4#1.5), 存储物柜V1.1 (J5#2.5 U4#2.5 U5#2.18)
RESET: cpu (U5#1.14), other (C21#1.1 J3#1.4 R17#1.1 SW4#1.1), power&down (D6#1.1), 存储物柜V1.1 (6 pins)
RXN: net_w5500 (J11#1.6 U9#1.5), 存储物柜V1.1 (C002.2 RN1.8 U9#2.5)
RXP: net_w5500 (J11#1.3 U9#1.6), 存储物柜V1.1 (C001.2 RN1.6 U9#2.6)
SIM900_RST: cpu (U5#1.66), gsm_sim900 (R23#1.1), 存储物柜V1.1 (R23#2.1 U5#2.66)
SIM_CLK: gsm_sim900 (R55#1.2 U11#1.32), 存储物柜V1.1 (R55#2.2 U11#2.32)
SIM_DATA: gsm_sim900 (R53#1.2 U11#1.31), 存储物柜V1.1 (R53#2.2 U11#2.31)
SIM_PWRKEY: cpu (U5#1.65), gsm_sim900 (R21#1.1), 存储物柜V1.1 (U5#2.65 X2.1)
SIM_RST: gsm_sim900 (R54#1.2 U11#1.33), 存储物柜V1.1 (R54#2.2 U11#2.33)
SIM_VDD: gsm_sim900 (U11#1.30 U12#1.6 U14#1.4), 存储物柜V1.1 (U11#2.30 U12#2.6 U14#2.4)
SPI1_MISO: cpu (U5#1.31), net_w5500 (U9#1.34), 存储物柜V1.1 (U5#2.31 U9#2.34)
SPI1_MOSI: cpu (U5#1.32), net_w5500 (U9#1.35), 存储物柜V1.1 (U5#2.32 U9#2.35)
SPI1_SCK: cpu (U5#1.30), net_w5500 (U9#1.33), 存储物柜V1.1 (U5#2.30 U9#2.33)
SPI2_MISO: cpu (U5#1.53), other (U3#1.2), 存储物柜V1.1 (U3#2.2 U5#2.53)
SPI2_MOSI: cpu (U5#1.54), other (U3#1.5), 存储物柜V1.1 (U3#2.5 U5#2.54)
SPI2_SCK: cpu (U5#1.52), other (U3#1.6), 存储物柜V1.1 (U3#2.6 U5#2.52)
SPK+: other (C17#1.1 J5#1.6), 存储物柜V1.1 (C17#2.1 J5#2.6)
SPK-: other (C18#1.1 J5#1.7), 存储物柜V1.1 (C18#2.1 J5#2.7)
TM_RxD: other (J7#1.2 U7#1.13), 存储物柜V1.1 (J7#2.2 U7#2.13)
TM_TxD: other (J7#1.3 U7#1.14), 存储物柜V1.1 (J7#2.3 U7#2.14)
TXN: net_w5500 (J11#1.2 U9#1.1), 存储物柜V1.1 (J11#2.2 RN1.4 U9#2.1)
TXP: net_w5500 (J11#1.1 U9#1.2), 存储物柜V1.1 (J11#2.1 RN1.2 U9#2.2)
USART_RX: other (R03#1.1 R04#1.1 U7#1.12), 存储物柜V1.1 (R03#2.1 R04#2.1 U7#2.12)
USART_TX: other (R01#1.1 R02#1.1 U7#1.11), 存储物柜V1.1 (R01#2.1 R02#2.1 U7#2.11)